# Altium project DB10005_DieBieMS.PrjPcb (part 1 of 2)
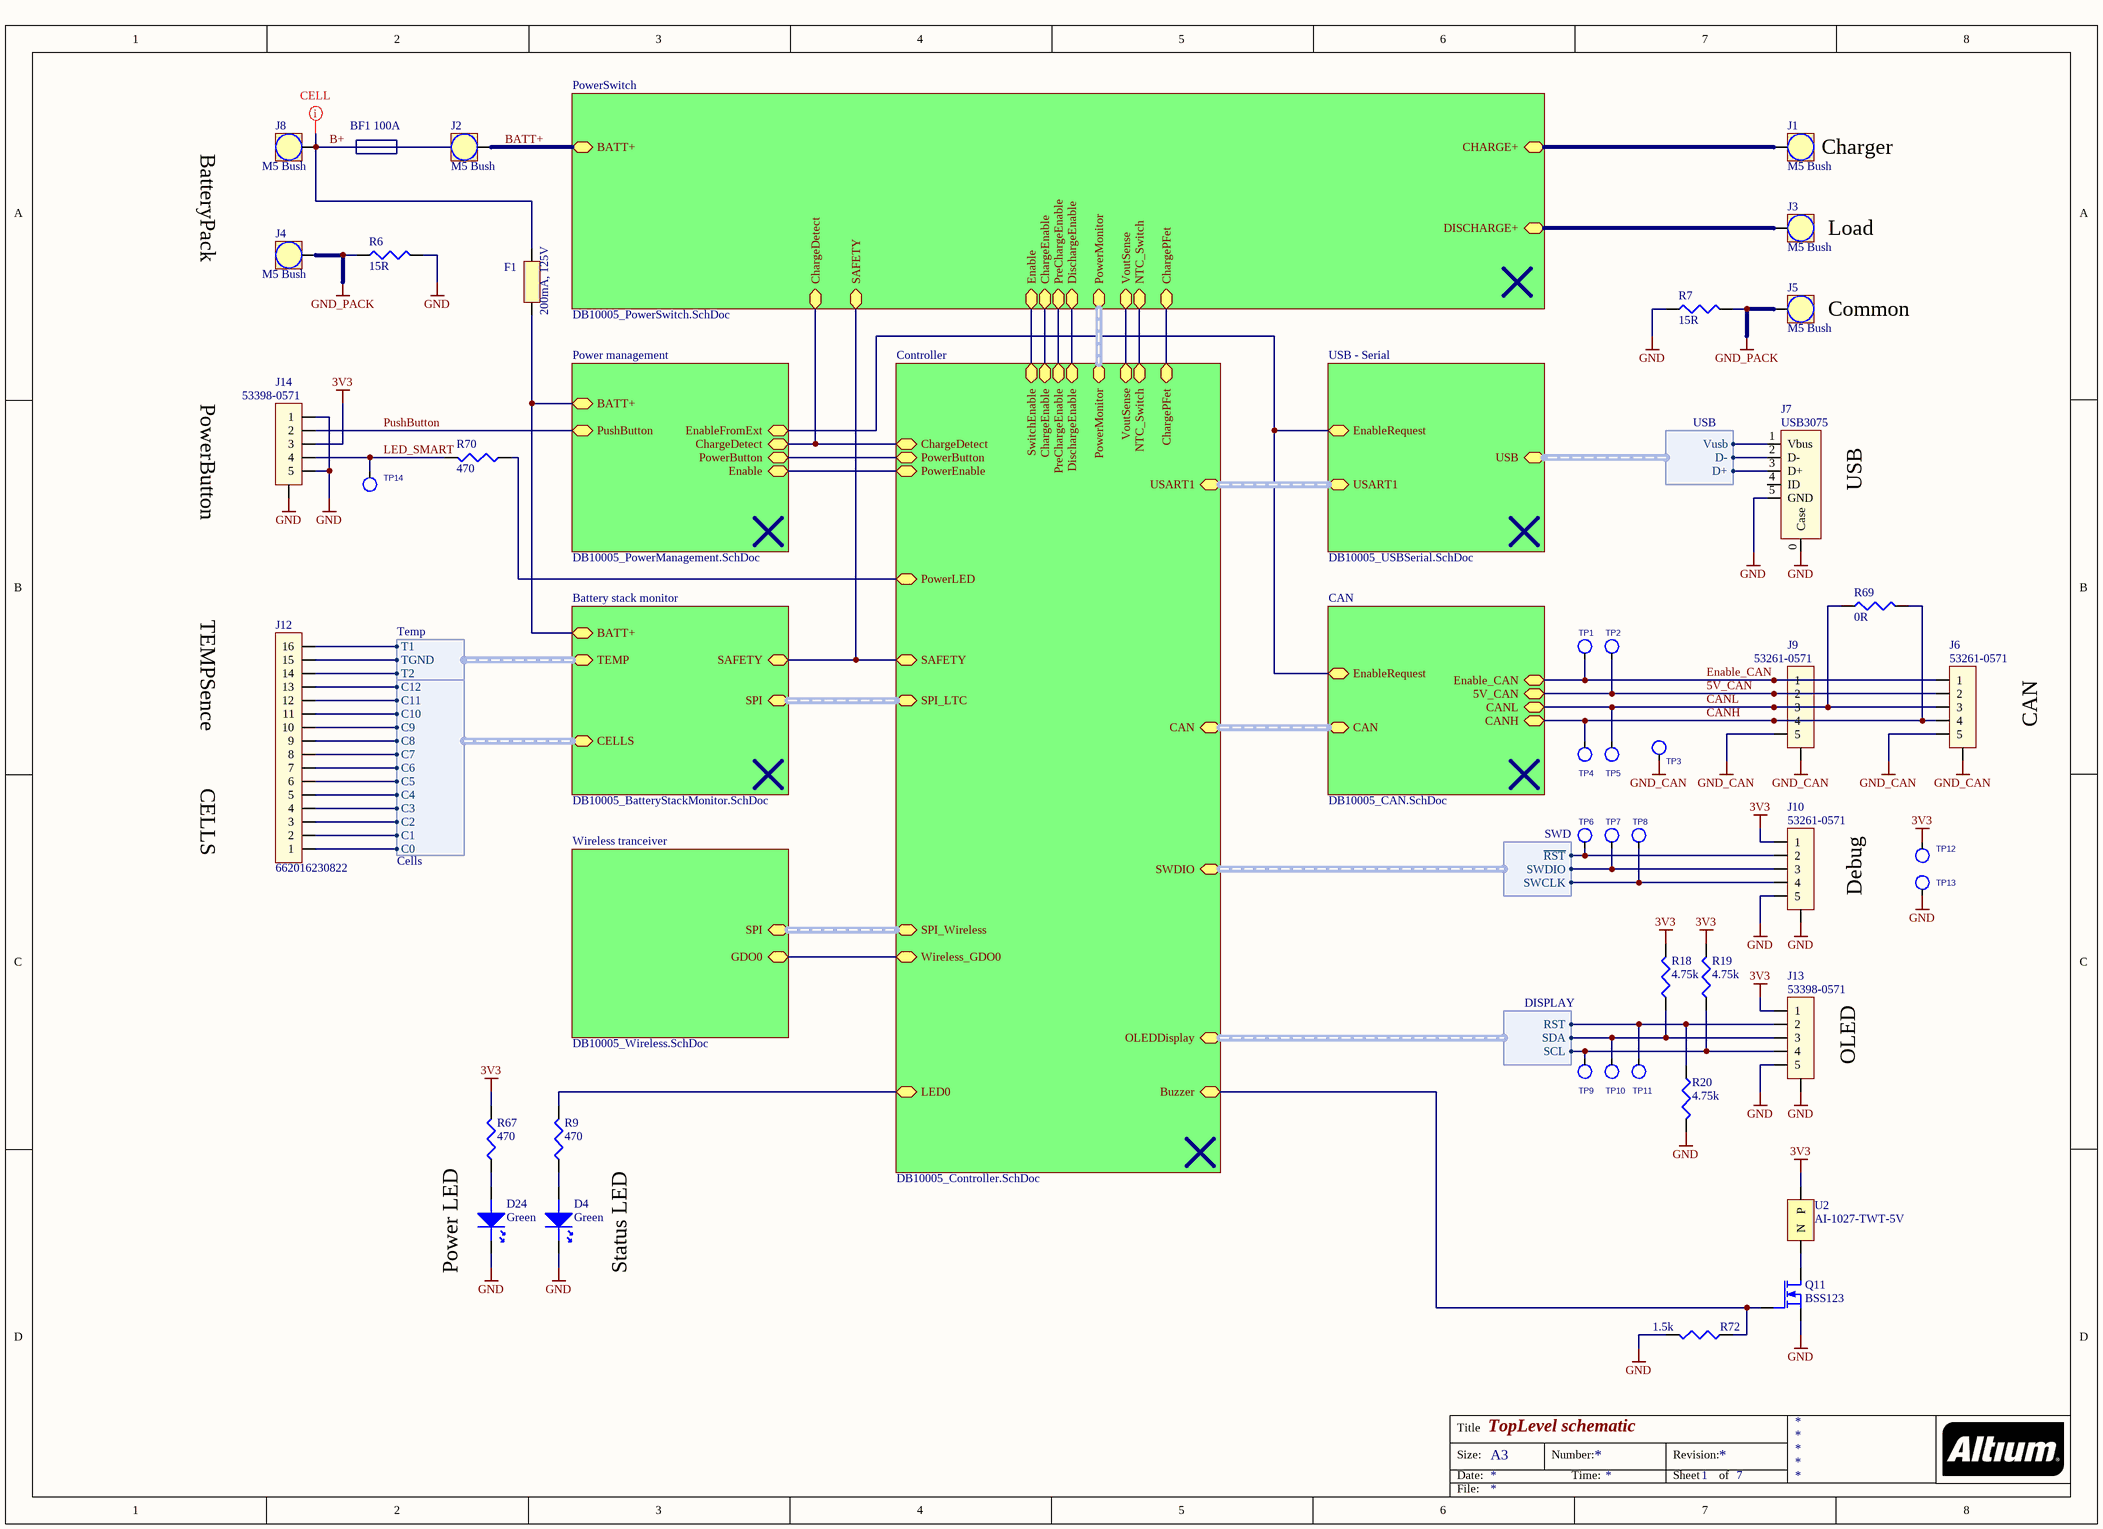
[diagram p0: DB10005_TopLevel.SchDoc]
10 sheets, 289 parts. Net scope: hierarchical (ports join the sheet entries above them; power ports are global).
Board file: DB10005_BMS.PcbDoc
Sheets:
  DB10005_TopLevel.SchDoc
    Battery stack monitor = DB10005_BatteryStackMonitor.SchDoc
      CELL1 = DB10005_CellNode.SchDoc
      CELL2 = DB10005_CellNode.SchDoc
      CELL3 = DB10005_CellNode.SchDoc
      CELL4 = DB10005_CellNode.SchDoc
      CELL5 = DB10005_CellNode.SchDoc
      CELL6 = DB10005_CellNode.SchDoc
      CELL7 = DB10005_CellNode.SchDoc
      CELL8 = DB10005_CellNode.SchDoc
      CELL9 = DB10005_CellNode.SchDoc
      CELL10 = DB10005_CellNode.SchDoc
      CELL11 = DB10005_CellNode.SchDoc
      CELL12 = DB10005_CellNode.SchDoc
    Controller = DB10005_Controller.SchDoc
    PowerSwitch = DB10005_PowerSwitch.SchDoc
    Power management = DB10005_PowerManagement.SchDoc
    CAN = DB10005_CAN.SchDoc
    USB - Serial = DB10005_USBSerial.SchDoc
    Wireless tranceiver = DB10005_Wireless.SchDoc
  DB10005_Software.SchDoc

## Sheet DB10005_TopLevel.SchDoc: TopLevel schematic
size A3; SheetNumber: 1; SheetTotal: 7

### Parts
D4  Green  [D-0805]
D24  Green  [D-0805]
F1  200mA, 125V  [F1206]
J1  M5 Bush  [7460408_HAL Surface]
J2  M5 Bush  [7460408_HAL Surface]
J3  M5 Bush  [7460408_HAL Surface]
J4  M5 Bush  [7460408_HAL Surface]
J5  M5 Bush  [7460408_HAL Surface]
J6  53261-0571  [53261-0571]
J7  USB3075  [USB3075 - NOSLOT]
J8  M5 Bush  [7460408_HAL Surface]
J9  53261-0571  [53261-0571]
J10  53261-0571  [53261-0571]
J12  662016230822  [662016230822]
J13  53398-0571  [53398-0571]
J14  53398-0571  [53398-0571]
Q11  BSS123  [SOT-23]
R6  15R  [2512]
R7  15R  [2512]
R9  470  [0402]
R18  4.75k  [0402]
R19  4.75k  [0402]
R20  4.75k  [0402]
R67  470  [0402]
R69  0R  [0805]
R70  470  [0402]
R72  1.5k  [0402]
TP1  1.3TP  [TP2-1.3MM]  (value not drawn)  (no BOM)
TP2  1.3TP  [TP2-1.3MM]  (value not drawn)  (no BOM)
TP3  1.3TP  [TP2-1.3MM]  (value not drawn)  (no BOM)
TP4  1.3TP  [TP2-1.3MM]  (value not drawn)  (no BOM)
TP5  1.3TP  [TP2-1.3MM]  (value not drawn)  (no BOM)
TP6  1.3TP  [TP2-1.3MM]  (value not drawn)  (no BOM)
TP7  1.3TP  [TP2-1.3MM]  (value not drawn)  (no BOM)
TP8  1.3TP  [TP2-1.3MM]  (value not drawn)  (no BOM)
TP9  1.3TP  [TP2-1.3MM]  (value not drawn)  (no BOM)
TP10  1.3TP  [TP2-1.3MM]  (value not drawn)  (no BOM)
TP11  1.3TP  [TP2-1.3MM]  (value not drawn)  (no BOM)
TP12  1.3TP  [TP2-1.3MM]  (value not drawn)  (no BOM)
TP13  1.3TP  [TP2-1.3MM]  (value not drawn)  (no BOM)
TP14  1.3TP  [TP2-1.3MM]  (value not drawn)  (no BOM)
U2  AI-1027-TWT-5V  [AI-1027-TWT]

### Sub-sheets
Battery stack monitor = DB10005_BatteryStackMonitor.SchDoc: SPI (harness SPI), CELLS (harness Cells), TEMP (harness Temp), BATT+, SAFETY
CAN = DB10005_CAN.SchDoc: CANH, CAN (harness CAN), CANL, 5V_CAN, Enable_CAN, EnableRequest
Controller = DB10005_Controller.SchDoc: SPI_LTC (harness SPI), PowerEnable, PowerButton, DischargeEnable, ChargeEnable, SwitchEnable, PreChargeEnable, CAN (harness CAN), USART1 (harness SERIAL), ChargeDetect, OLEDDisplay (harness DISPLAY), PowerLED, LED0, PowerMonitor (harness ISL), SWDIO (harness SWD), VoutSense, Buzzer, SAFETY, NTC_Switch, SPI_Wireless (harness SPI), Wireless_GDO0, ChargePFet
Power management = DB10005_PowerManagement.SchDoc: Enable, PowerButton, ChargeDetect, EnableFromExt, PushButton, BATT+
PowerSwitch = DB10005_PowerSwitch.SchDoc: DischargeEnable, ChargeEnable, Enable, PreChargeEnable, ChargeDetect, CHARGE+, DISCHARGE+, BATT+, PowerMonitor (harness ISL), VoutSense, SAFETY, NTC_Switch, ChargePFet
USB - Serial = DB10005_USBSerial.SchDoc: USB (harness USB), USART1 (harness SERIAL), EnableRequest
Wireless tranceiver = DB10005_Wireless.SchDoc: SPI (harness SPI), GDO0

### Harnesses
USB: Vusb, D+, D-
Cells: C1, C9, C2, C3, C4, C5, C6, C7, C8, C10, C11, C0, C12
Temp: T1, T2, TGND
DISPLAY: SDA, SCL, RST
SWD: SWCLK, SWDIO, ~{RST}

### Nets
3V3: J10.1 J13.1 J14.3 R18.2 R19.2 R67.2 TP12.1(TP) U2.P
5V_CAN: J6.2 J9.2 TP2.1(TP) ; sheet CAN/5V_CAN
GND: D4.K D24.K J7.0(Case) J7.5(GND) J10.0(SHLD) J10.5 J13.0(SHLD) J13.5 J14.0(SHLD) J14.1 J14.5 Q11.S R6.2 R7.2 R20.2 R72.2 TP13.1(TP)
GND_CAN: J6.0(SHLD) J6.5 J9.0(SHLD) J9.5 TP3.1(TP)
GND_PACK: J4.1 J5.1 R6.1 R7.1
B+: F1.2 J8.1
BATT+: J2.1 ; sheet PowerSwitch/BATT+
Buzzer: Q11.G R72.1 ; sheet Controller/Buzzer
CANH: J6.4 J9.4 R69.2 TP4.1(TP) ; sheet CAN/CANH
CANL: J6.3 J9.3 R69.1 TP5.1(TP) ; sheet CAN/CANL
ChargeEnable: sheet Controller/ChargeEnable, sheet PowerSwitch/ChargeEnable
ChargeIn: J1.1 ; sheet PowerSwitch/CHARGE+
CN1: J12.1 ; sheet Battery stack monitor/CELLS.C0
CN2: J12.2 ; sheet Battery stack monitor/CELLS.C1
CN3: J12.3 ; sheet Battery stack monitor/CELLS.C2
CN4: J12.4 ; sheet Battery stack monitor/CELLS.C3
CN5: J12.5 ; sheet Battery stack monitor/CELLS.C4
CN6: J12.6 ; sheet Battery stack monitor/CELLS.C5
CN7: J12.7 ; sheet Battery stack monitor/CELLS.C6
CN8: J12.8 ; sheet Battery stack monitor/CELLS.C7
CN9: J12.9 ; sheet Battery stack monitor/CELLS.C8
CN10: J12.10 ; sheet Battery stack monitor/CELLS.C9
CN11: J12.11 ; sheet Battery stack monitor/CELLS.C10
CN12: J12.12 ; sheet Battery stack monitor/CELLS.C11
CP12: J12.13 ; sheet Battery stack monitor/CELLS.C12
DischargeEnable: sheet Controller/DischargeEnable, sheet PowerSwitch/DischargeEnable
Enable_CAN: J6.1 J9.1 TP1.1(TP) ; sheet CAN/Enable_CAN
LED0: R9.2 ; sheet Controller/LED0
LED_SMART: J14.4 R70.2 TP14.1(TP)
LoadOut: J3.1 ; sheet PowerSwitch/DISCHARGE+
OLED_RST: J13.2 R20.1 TP11.1(TP) ; sheet Controller/OLEDDisplay.RST
OLED_SCL: J13.4 R19.1 TP9.1(TP) ; sheet Controller/OLEDDisplay.SCL
OLED_SDA: J13.3 R18.1 TP10.1(TP) ; sheet Controller/OLEDDisplay.SDA
PowerButton: sheet Controller/PowerButton, sheet Power management/PowerButton
PowerEnable: sheet Controller/PowerEnable, sheet Power management/Enable
PowerLED: R70.1 ; sheet Controller/PowerLED
PreChargeEnable: sheet Controller/PreChargeEnable, sheet PowerSwitch/PreChargeEnable
PushButton: J14.2 ; sheet Power management/PushButton
~{RST}: J10.2 TP6.1(TP) ; sheet Controller/SWDIO.~{RST}
SWCLK: J10.4 TP8.1(TP) ; sheet Controller/SWDIO.SWCLK
SWDIO: J10.3 TP7.1(TP) ; sheet Controller/SWDIO.SWDIO
SwitchEnable: sheet Controller/SwitchEnable, sheet PowerSwitch/Enable
VoutSense: sheet Controller/VoutSense, sheet PowerSwitch/VoutSense
Wireless_GDO0: sheet Controller/Wireless_GDO0, sheet Wireless tranceiver/GDO0
NetC17_2: J7.1(Vbus) ; sheet USB - Serial/USB.Vusb
NetC40_2: J12.16 ; sheet Battery stack monitor/TEMP.T1
NetC41_2: J12.14 ; sheet Battery stack monitor/TEMP.T2
NetC42_1: sheet Controller/NTC_Switch, sheet PowerSwitch/NTC_Switch
NetD2_4: sheet Controller/ChargeDetect, sheet PowerSwitch/ChargeDetect, sheet Power management/ChargeDetect
NetD3_K1: J7.2(D-) ; sheet USB - Serial/USB.D-
NetD3_K2: J7.3(D+) ; sheet USB - Serial/USB.D+
NetD4_A: D4.A R9.1
NetD6_4: sheet Power management/EnableFromExt, sheet CAN/EnableRequest, sheet USB - Serial/EnableRequest
NetD24_A: D24.A R67.1
NetF1_1: F1.1 ; sheet Battery stack monitor/BATT+, sheet Power management/BATT+
NetIC1_2: sheet Battery stack monitor/SAFETY, sheet Controller/SAFETY, sheet PowerSwitch/SAFETY
NetJ12_15: J12.15 ; sheet Battery stack monitor/TEMP.TGND
NetQ11_D: Q11.D U2.N
(unnamed): sheet Controller/ChargePFet, sheet PowerSwitch/ChargePFet

Not connected (* = marked no-connect by the designer): J7 4(ID)

### Buses and harness runs
harness sheet Battery stack monitor/SPI = sheet Controller/SPI_LTC
harness sheet CAN/CAN = sheet Controller/CAN
harness sheet Controller/PowerMonitor = sheet PowerSwitch/PowerMonitor
harness sheet Controller/SPI_Wireless = sheet Wireless tranceiver/SPI
harness sheet Controller/USART1 = sheet USB - Serial/USART1

### Layout directives
net class CELL: B+

### Notes on the sheet
- (near J8) BF1 100A
- BatteryPack
- (near J1) Charger
- (near J3) Load
- (near J5) Common
- PowerButton
- (near J7) USB
- TEMPSence
- CAN
- CELLS
- Debug
- (near J13) OLED
- Power LED
- Status LED
- Title
- Size:
- Date:
- A3
- Number:
- Time:
- Revision:
- Sheet
- of
- File:

### Library data of the parts
D4 D24 = KP-2012SGC: Led, Green, Li:12mcd, Vf:2.2V, If:0.02A; Brand: KingBright; Case Style: 0805; Forward Current: 0.02A; Forward Voltage: 2.2V; Luminous Intensity: 12mcd; Brand Number: KP-2012SGC; Order Code Supplier: 1318243; Price: 0,06; Supplier: Farnell; Temperature Range: -30°C to +85°C
F1 = 0466.200NR: Fuse, Slow Blow, 200 mA, 125 VAC, 125 VDC; Brand: LITTELFUSE; Prijs: 0,347; Order Code Supplier: 1596522; Brand Number: 0466.200NR; Supplier: Farnell
J1-J5 J8 = 7460408: Bush with Circumference M5; Brand: Wurth; Case Style: M5Bush; Brand Number: 7460408; Order Code Supplier: 1821279; Price: 4,17; Supplier: Farnell
J6 J9 J10 = 53261-0571: PicoBlade 53261 Series, 5Pin, Right Angle; Brand: MOLEX; Pitch: 1.25mm; Brand Number: 53261-0571; Case Style: 53261-0571; Order Code Supplier: 1125360; Price: 1,20; Supplier: Farnell
J7 = USB3075: USB 2.0 MICRO B, RCPT, 5POS, SMT; Brand: Global Connector Technology; Brand Number: USB3075-30-A; Case Style: Micro B SMT; Pitch: 0.8mm; Order Code Supplier: 2443116; Price: 0,313; Supplier: Farnell
J12 = 662016230822: WR-MPC3 Series, Surface Mount, Header, 16 Contacts, 3 mm; Brand: Wurth; Case Style: 3mm BoxHeader; Pitch: 3mm; Brand Number: 662016230822; Order Code Supplier: 2113471; Price: 2,67; Supplier: Farnell
J13 J14 = 53398-0571: PicoBlade 53398 Series, 5Pin, Right Angle; Brand: MOLEX; Pitch: 1.25mm; Brand Number: 53398-0571; Case Style: 53398-0571; Order Code Supplier: 1125354; Price: 1,55; Supplier: Farnell
Q11 = BSS123: Mosfet, N-channel, Vds:100V, Id:0.15A, Vgs-th:2.8V, Rds-on:3.5ohm; Brand: NXP; Drain Current: 0.15A; Drain Source Voltage: 100V; Gate Source Voltage: 20V; On Resistance: 3.5ohm; Threshold Voltage: 2.8V; Brand Number: BSS123; Case Style: SOT-23; Order Code Supplier: 1510764; Price: 0,082; Supplier: Farnell; Temperature Range: -55°C to +150°C; Transistor Polarity: N-channel
R6 R7 = 15/2512/2W/250V: Resistor, 15R, 1%, 2W, 200V, 200PPM, 2512; Brand: TE CONNECTIVITY / CGS; Brand Number: 352115RFT; Voltage Rating: 250V; Case Style: 2512; Order Code Supplier: 2117454; Power Rating: 2W; Price: 0,30; Resistance: 15R; Supplier: Farnell; Temperature Coefficient: ± 200PPM; Temperature Range: -55°C to +125°C
R9 R67 R70 = 470/0402/0063W/50V: Resistor, 470, 1%, 0.0625W, 50V, 100PPM, 0402; Brand: VISHAY DRALORIC; Brand Number: CRG0402F470R; Power Rating: 0.063W; Case Style: 0402; Order Code Supplier: 2331533; Price: 0,0099; Resistance: 470; Supplier: Farnell; Temperature Coefficient: ± 100PPM; Temperature Range: -55°C to +125°C; Voltage Rating: 50V
R18-R20 = 4.75k/0402/0063W/50V: Resistor, 4.75k, 0.1%, 0.0625W, 50V, 100PPM, 0402; Brand: VISHAY DRALORIC; Brand Number: CRCW04024K75FKED; Power Rating: 0.063W; Case Style: 0402; Order Code Supplier: 2121689; Price: 0,0006; Resistance: 4.75k; Supplier: Farnell; Temperature Coefficient: ± 100PPM; Temperature Range: -55°C to +125°C; Voltage Rating: 50V
R69 = 0/0805/0100W/150V: Resistor, 0R, 0.1%, 0.1W, 150V, 200PPM, 0805; Brand: MULTICOMP; Brand Number: MC 0.1W 0805 0R; Case Style: 0805; Order Code Supplier: 9333681; Power Rating: 0.1W; Price: 0,038; Resistance: 0R; Supplier: Farnell; Temperature Coefficient: ± 200PPM; Temperature Range: -55°C to +125°C; Voltage Rating: 150V
R72 = 1.5k/0402/0063W/50V: Resistor, 1.5k, 0.1%, 0.0625W, 50V, 100PPM, 0402; Brand: VISHAY DRALORIC; Brand Number: CRCW04021K50FKED; Power Rating: 0.063W; Case Style: 0402; Order Code Supplier: 2121624; Price: 0,0054; Resistance: 1.5k; Supplier: Farnell; Temperature Coefficient: ± 100PPM; Temperature Range: -55°C to +125°C; Voltage Rating: 50V
TP1-TP14 = TESTPT4: 1.3mm
U2 = AI-1027-TWT-5V-2-R: EM 5VDC 2300Hz 82dBA Continuous Top Fire; Brand: PUI Audio; Brand Number: AI-1027-TWT-5V-2-R; Case Style: AI-1027-TWT-5V-2-R; Price: 1,73; Order Code Supplier: 665-AI1027TWT5V2R; Supplier: Mouser

## Sheet DB10005_BatteryStackMonitor.SchDoc: Battery stack monitor
size A3; SheetNumber: 2; SheetTotal: 7
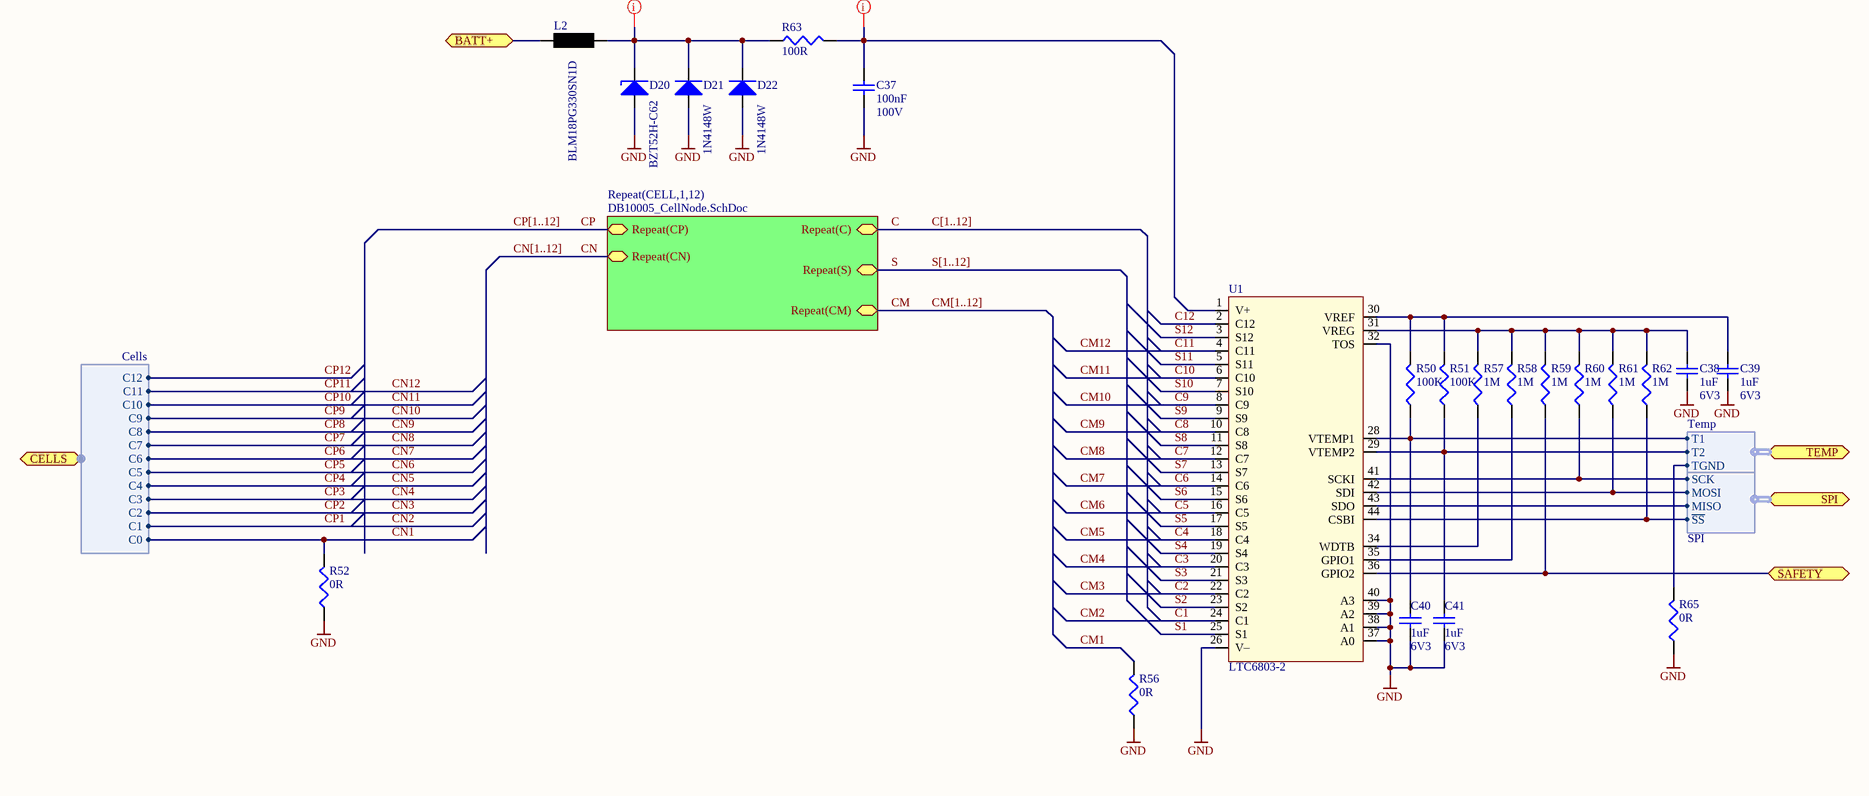
[diagram p1: DB10005_BatteryStackMonitor.SchDoc]

### Parts
C37  100nF  Voltage Rating: 100V  [C-0805]
C38  1uF  Voltage Rating: 6V3  [C0402]
C39  1uF  Voltage Rating: 6V3  [C0402]
C40  1uF  Voltage Rating: 6V3  [C0402]
C41  1uF  Voltage Rating: 6V3  [C0402]
D20  BZT52H-C62  [SOD123W]
D21  1N4148W  [SOD123]
D22  1N4148W  [SOD123]
L2  BLM18PG330SN1D  [L0603]
R50  100K  [0402]
R51  100K  [0402]
R52  0R  [0603]
R56  0R  [0603]
R57  1M  [0402]
R58  1M  [0402]
R59  1M  [0402]
R60  1M  [0402]
R61  1M  [0402]
R62  1M  [0402]
R63  100R  [0603]
R65  0R  [0603]
U1  LTC6803-2  [SSOP44]

### Sub-sheets
Repeat(CELL,1,12) = DB10005_CellNode.SchDoc: Repeat(CN), Repeat(CP), Repeat(S), Repeat(C), Repeat(CM)

### Ports
BATT+, CELLS (harness Cells), SAFETY, SPI (harness SPI), TEMP (harness Temp)

### Harnesses
SPI: ~{SS}, SCK, MISO, MOSI
Cells: C1, C9, C2, C3, C4, C5, C6, C7, C8, C10, C11, C0, C12
Temp: T1, T2, TGND

### Nets
GND: C37.1 C38.1 C39.1 C40.1 C41.1 D20.1 D21.1(A) D22.1(A) R52.1 R56.1 R65.1 U1.26(V–) U1.32(TOS) U1.37(A0) U1.38(A1) U1.39(A2) U1.40(A3)
C: sheet Repeat(CELL,1,12)/Repeat(C)
C1: U1.24(C1)  [also labelled CM2]
C2: U1.22(C2)  [also labelled CM3]
C3: U1.20(C3)  [also labelled CM4]
C4: U1.18(C4)  [also labelled CM5]
C5: U1.16(C5)  [also labelled CM6]
C6: U1.14(C6)  [also labelled CM7]
C7: U1.12(C7)  [also labelled CM8]
C8: U1.10(C8)  [also labelled CM9]
C9: U1.8(C9)  [also labelled CM10]
C10: U1.6(C10)  [also labelled CM11]
C11: U1.4(C11)  [also labelled CM12]
C12: U1.2(C12)
CM: sheet Repeat(CELL,1,12)/Repeat(CM)
CM1: R56.2
CN: sheet Repeat(CELL,1,12)/Repeat(CN)
CN1: R52.2 ; port CELLS.C0
CP: sheet Repeat(CELL,1,12)/Repeat(CP)
MISO: U1.43(SDO) ; port SPI.MISO
MOSI: R61.1 U1.42(SDI) ; port SPI.MOSI
S: sheet Repeat(CELL,1,12)/Repeat(S)
S1: U1.25(S1)
S2: U1.23(S2)
S3: U1.21(S3)
S4: U1.19(S4)
S5: U1.17(S5)
S6: U1.15(S6)
S7: U1.13(S7)
S8: U1.11(S8)
S9: U1.9(S9)
S10: U1.7(S10)
S11: U1.5(S11)
S12: U1.3(S12)
~{SS}: R62.1 U1.44(CSBI) ; port SPI.~{SS}
SCK: R60.1 U1.41(SCKI) ; port SPI.SCK
NetC37_2: C37.2 R63.2 U1.1(V+)
NetC38_2: C38.2 R57.2 R58.2 R59.2 R60.2 R61.2 R62.2 U1.31(VREG)
NetC39_2: C39.2 R50.2 R51.2 U1.30(VREF)
NetC40_2: C40.2 R50.1 U1.28(VTEMP1) ; port TEMP.T1
NetC41_2: C41.2 R51.1 U1.29(VTEMP2) ; port TEMP.T2
NetD20_2: D20.2 D21.2(K) D22.2(K) L2.2 R63.1
NetF1_1: L2.1 ; port BATT+
NetIC1_2: R59.1 U1.36(GPIO2) ; port SAFETY
NetJ12_15: R65.2 ; port TEMP.TGND
NetR57_1: R57.1 U1.34(WDTB)
NetR58_1: R58.1 U1.35(GPIO1)

### Buses and harness runs
bus C[1..12]
bus CM[1..12]
bus CN[1..12]
bus CP[1..12]
bus S[1..12]

### Layout directives
net class CELL: NetC37_2, NetD20_2

### Notes on the sheet
- Title
- Size:
- Date:
- A3
- Number:
- Time:
- Revision:
- Sheet
- of
- File:

### Library data of the parts
C37 = 100nF/0805/CER/100V: Capacitor, 100nF, 100V, X7R; Capacitance Tolerance: ± 10%; Capacitor Case Style: 0805; Brand Number: C0805C104K1RACTU; Brand: KEMET; Dielectric Characteristic: X7R; Capacitance: 100nF; Temperature Range: -55°C to +125°C; Price: 0,096; Order Code Supplier: 1650862; Supplier: Farnell
C38-C41 = 1uF/0402/CER/6.3V: Capacitor, 1uF, 6.3V, X5R; Capacitance Tolerance: ± 10%; Capacitor Case Style: 0402; Brand Number: 04026D105KAT2A; Brand: AVX; Dielectric Characteristic: X5R; Capacitance: 1uF; Temperature Range: -55°C to +85°C; Price: 0,0874; Order Code Supplier: 1327658; Supplier: Farnell
D20 = BZT52H-C62,115: Diode Zener, Vz: 62V, If: 0.25A, Vf: 0.9V; Brand: NXP; Case Style: SOD-123F; Brand Number: BZT52H-C62,115; Forward Current: 0.25A; Forward Voltage: 0.9V; Order Code Supplier: 1757813RL; Price: 0,053; Supplier: Farnell; Temperature Range: -65°C to +150°C; Zener Voltage: 62V
D21 D22 = MMSD4148T1G: Diode, Vrrm: 100V, If: 0.15A, Vf: 1V; Brand: ON SEMICONDUCTOR; Case Style: SOD-123; Forward Current: 0.2A; Brand Number: MMSD4148T1G; Forward Voltage: 1V; Order Code Supplier: 9556079; Price: 0,19; Supplier: Farnell; Temperature Range: -65°C to +150°C; Vrrm: 100V
L2 = BLM18PG330SN1D: Ferrite Bead, Impedance:33ohm, DC Resistance Max:0.025ohm, DC Current Rating:3A; Brand: MURATA; Case Style: 0603; Brand Number: BLM18PG330SN1D; Price: 0,048; Supplier: Farnell; Order Code Supplier: 1515742
R50 R51 = 100k/0402/0063W/50V: Resistor, 100k, 0.1%, 0.0625W, 50V, 100PPM, 0402; Brand: VISHAY DRALORIC; Brand Number: CRCW0402100KFKED; Power Rating: 0.063W; Case Style: 0402; Order Code Supplier: 2121857; Price: 0,0004; Resistance: 100K; Supplier: Farnell; Temperature Coefficient: ± 100PPM; Temperature Range: -55°C to +125°C; Voltage Rating: 50V
R52 R56 R65 = 0/0603/0063W/50V: Resistor, 0R, 0.1%, 0.063W, 50V, 200PPM, 0603; Brand: VISHAY DRALORIC; Brand Number: CRCW06030000Z0EA; Case Style: 0603; Order Code Supplier: 2122112; Power Rating: 0.063W; Price: 0,043; Resistance: 0R; Supplier: Farnell; Temperature Coefficient: ± 200PPM; Temperature Range: -55°C to +125°C; Voltage Rating: 50V
R57-R62 = 1M/0402/0063W/50V: Resistor, 1M, 0.1%, 0.0625W, 50V, 100PPM, 0402; Brand: VISHAY DRALORIC; Brand Number: CRCW04021M00FKED; Power Rating: 0.063W; Case Style: 0402; Order Code Supplier: 2121984; Price: 0,0006; Resistance: 1M; Supplier: Farnell; Temperature Coefficient: ± 100PPM; Temperature Range: -55°C to +125°C; Voltage Rating: 50V
R63 = 100/0603/0063W/50V: Resistor, 100R, 1%, 0.063W, 50V, 200PPM, 0603; Brand: VISHAY DRALORIC; Brand Number: CRCW0603100RFKEA; Case Style: 0603; Order Code Supplier: 2122239; Power Rating: 0.063W; Price: 0,007; Resistance: 100R; Supplier: Farnell; Temperature Coefficient: ± 200PPM; Temperature Range: -55°C to +125°C; Voltage Rating: 50V
U1 = LTC6803-2: Multicell Battery Stack Monitor, T:-40°C to +85°C; Brand Number: LTC6803IG-2#PBF; Brand: Linear Technology; Case Style: SSOP-44; Price: 14,08; Supplier: RS-Online; Temperature Range: -40°C to 85°C; Order Code Supplier: 858-0829

## Sheet DB10005_CellNode.SchDoc
size A4
Used 12 times, as channels Battery stack monitor/CELL1, Battery stack monitor/CELL2, Battery stack monitor/CELL3, Battery stack monitor/CELL4, Battery stack monitor/CELL5, Battery stack monitor/CELL6, Battery stack monitor/CELL7, Battery stack monitor/CELL8, Battery stack monitor/CELL9, Battery stack monitor/CELL10, Battery stack monitor/CELL11, Battery stack monitor/CELL12. Parts and nets are listed once, with the designators drawn on the sheet.
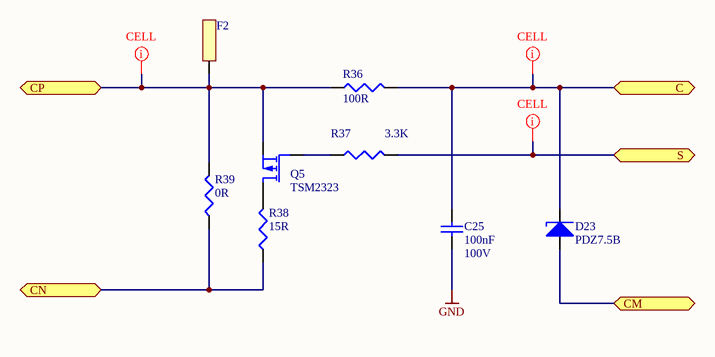
[diagram p2: DB10005_CellNode.SchDoc]

### Parts
C25  100nF  Voltage Rating: 100V  [C-0805]
D23  PDZ7.5B  [SOD-323]
F2  PCB Fuse  [0603_Fuse_0_2MM]  (value not drawn)  (no BOM)
Q5  TSM2323  [SOT-23]
R36  100R  [0603]
R37  3.3K  [0603]
R38  15R  [2512]
R39  0R  [0805]

### Ports
C, CM, CN, CP, S

### Nets
GND: C25.1
C: C25.2 D23.2 R36.2 ; port C
CM: D23.1 ; port CM
CN: R38.1 R39.1 ; port CN
CP: F2.1 Q5.S R36.1 R39.2 ; port CP
S: R37.2 ; port S
NetQ5_D: Q5.D R38.2
NetQ5_G: Q5.G R37.1

### Channels
Battery stack monitor/CELL1: designators end in _CELL1; ports C=C1 CM=CM1 CN=CN1 CP=CN2 S=S1
Battery stack monitor/CELL2: designators end in _CELL2; ports C=C2 CM=C1 CN=CN2 CP=CN3 S=S2
Battery stack monitor/CELL3: designators end in _CELL3; ports C=C3 CM=C2 CN=CN3 CP=CN4 S=S3
Battery stack monitor/CELL4: designators end in _CELL4; ports C=C4 CM=C3 CN=CN4 CP=CN5 S=S4
Battery stack monitor/CELL5: designators end in _CELL5; ports C=C5 CM=C4 CN=CN5 CP=CN6 S=S5
Battery stack monitor/CELL6: designators end in _CELL6; ports C=C6 CM=C5 CN=CN6 CP=CN7 S=S6
Battery stack monitor/CELL7: designators end in _CELL7; ports C=C7 CM=C6 CN=CN7 CP=CN8 S=S7
Battery stack monitor/CELL8: designators end in _CELL8; ports C=C8 CM=C7 CN=CN8 CP=CN9 S=S8
Battery stack monitor/CELL9: designators end in _CELL9; ports C=C9 CM=C8 CN=CN9 CP=CN10 S=S9
Battery stack monitor/CELL10: designators end in _CELL10; ports C=C10 CM=C9 CN=CN10 CP=CN11 S=S10
Battery stack monitor/CELL11: designators end in _CELL11; ports C=C11 CM=C10 CN=CN11 CP=CN12 S=S11
Battery stack monitor/CELL12: designators end in _CELL12; ports C=C12 CM=C11 CN=CN12 CP=CP12 S=S12

### Layout directives
net class CELL: C1, CN2, S1

### Library data of the parts
C25 = 100nF/0805/CER/100V: as C37 on sheet DB10005_BatteryStackMonitor; Dielectric Characteristic: X7R; Capacitance: 100nF; Temperature Range: -55°C to +125°C; Price: 0,096; Order Code Supplier: 1650862; Supplier: Farnell
D23 = PDZ7.5B: Diode, Vrrm: 7.5V, If: 0.2A, Vf: 0.9V; Brand: NXP; Brand Number: PDZ7.5B,115; Case Style: SOD-323; Forward Current: 0.2A; Forward Voltage: 0.9V; Order Code Supplier: 2319197; Price: 0,263; Supplier: Farnell; Temperature Range: -65°C to +150°C; Zener Voltage: 7.5V
F2 = PCBFuse_0_2MM: Fuse, PCB, 1A, 60V, T:-40°C +85°C; Price: 0,00; Order Code Supplier: -; Brand: -; Brand Number: -; Supplier: Farnell
Q5 = TSM2323: Mosfet, P-channel, Vds:20V, Id:4.7A, Vgs-th:1V, Rds-on:0.039ohm; Brand: Taiwan Semiconductor; Brand Number: TSM2323CX; Drain Current: 4.7A; Drain Source Voltage: 20V; Gate Source Voltage: 8V; Threshold Voltage: 1V; Case Style: SOT-23; On Resistance: 0.039ohm; Order Code Supplier: 1864590; Price: 0,195; Supplier: Farnell; Temperature Range: -55°C to +150°C; Transistor Polarity: P-channel
R36 = 100/0603/0063W/50V: as R63 on sheet DB10005_BatteryStackMonitor; Case Style: 0603; Order Code Supplier: 2122239; Power Rating: 0.063W; Price: 0,007; Resistance: 100R; Supplier: Farnell; Temperature Coefficient: ± 200PPM; Temperature Range: -55°C to +125°C; Voltage Rating: 50V
R37 = 3.3K/0603/0125W/50V: Resistor, 3.3K, 1%, 0.125W, 50V, 100PPM, 0603; Brand: MULTICOMP; Brand Number: MCHP03W8F3301T5E; Case Style: 0603; Order Code Supplier: 1576291; Power Rating: 0.125W; Price: 0,08; Resistance: 3.3K; Supplier: Farnell; Temperature Coefficient: ± 100PPM; Temperature Range: -55°C to +155°C; Voltage Rating: 50V
R38 = 15/2512/2W/250V: as R6 on sheet DB10005_TopLevel; Case Style: 2512; Order Code Supplier: 2117454; Power Rating: 2W; Price: 0,30; Resistance: 15R; Supplier: Farnell; Temperature Coefficient: ± 200PPM; Temperature Range: -55°C to +125°C
R39 = 0/0805/0100W/150V: as R69 on sheet DB10005_TopLevel; Case Style: 0805; Order Code Supplier: 9333681; Power Rating: 0.1W; Price: 0,038; Resistance: 0R; Supplier: Farnell; Temperature Coefficient: ± 200PPM; Temperature Range: -55°C to +125°C; Voltage Rating: 150V

## Sheet DB10005_Controller.SchDoc: Controller
size A3; SheetNumber: 3; SheetTotal: 7
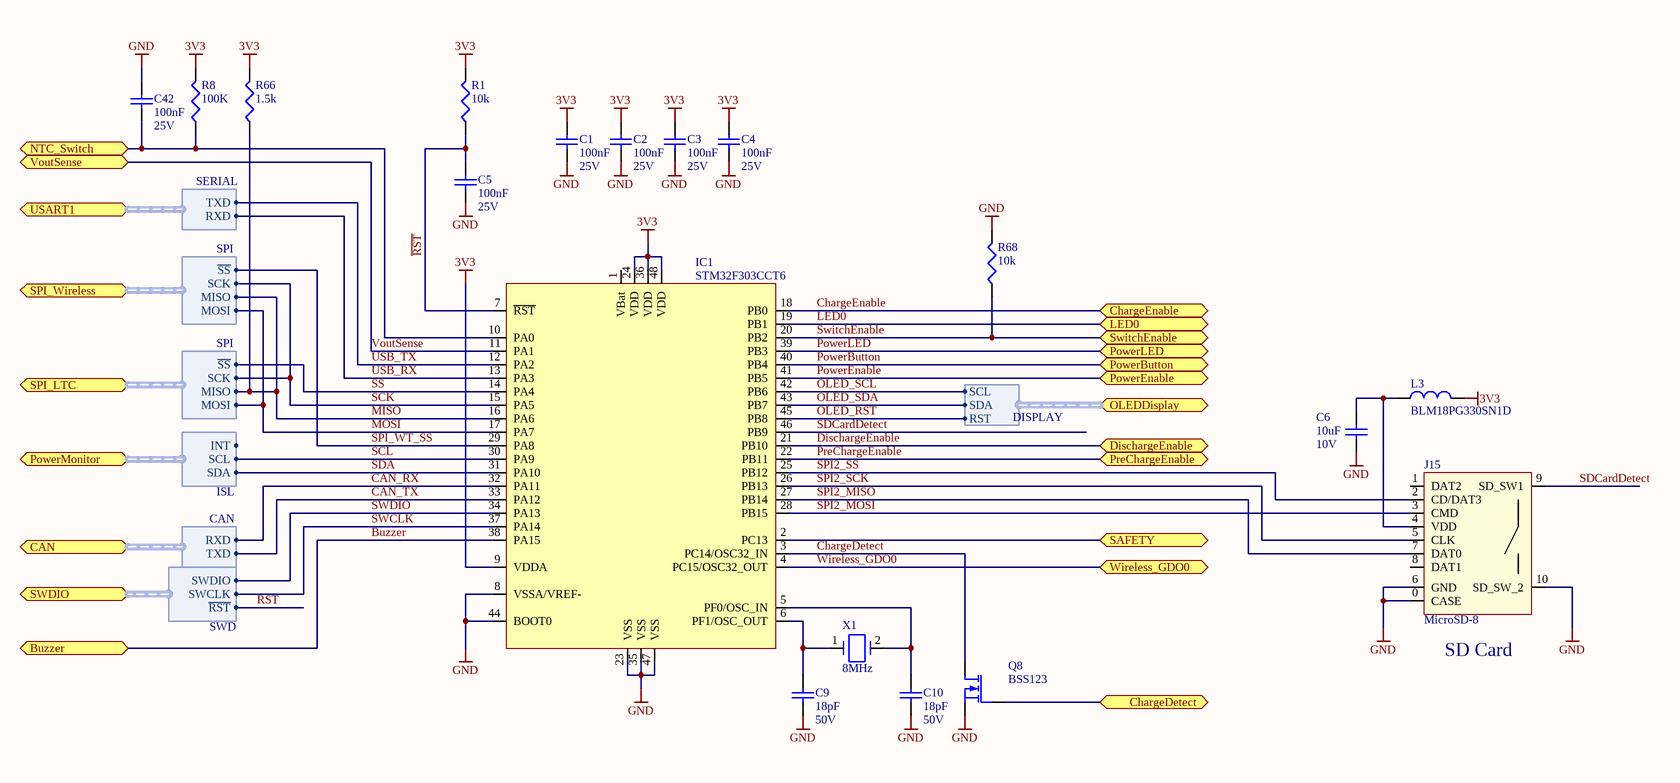
[diagram p3: DB10005_Controller.SchDoc]

### Parts
C1  100nF  Voltage Rating: 25V  [C0402]
C2  100nF  Voltage Rating: 25V  [C0402]
C3  100nF  Voltage Rating: 25V  [C0402]
C4  100nF  Voltage Rating: 25V  [C0402]
C5  100nF  Voltage Rating: 25V  [C0402]
C6  10uF  Voltage Rating: 10V  [C-0805]
C9  18pF  Voltage Rating: 50V  [C0402]
C10  18pF  Voltage Rating: 50V  [C0402]
C42  100nF  Voltage Rating: 25V  [C0402]
IC1  STM32F303CCT6  [LQFP48]
J15  MicroSD-8  [microSD]
L3  BLM18PG330SN1D  [L0603]
Q8  BSS123  [SOT-23]
R1  10k  [0402]
R8  100K  [0402]
R66  1.5k  [0402]
R68  10k  [0402]
X1  8MHz  [XTAL150SMD_125X196]

### Ports
Buzzer, CAN (harness CAN), ChargeDetect, ChargeEnable, DischargeEnable, LED0, NTC_Switch, OLEDDisplay (harness DISPLAY), PowerButton, PowerEnable, PowerLED, PowerMonitor (harness ISL), PreChargeEnable, SAFETY, SPI_LTC (harness SPI), SPI_Wireless (harness SPI), SWDIO (harness SWD), SwitchEnable, USART1 (harness SERIAL), VoutSense, Wireless_GDO0

### Harnesses
SERIAL: RXD, TXD
DISPLAY: SDA, SCL, RST
CAN: RXD, TXD
SPI: ~{SS}, SCK, MISO, MOSI
ISL: SDA, SCL, INT
SWD: SWCLK, SWDIO, ~{RST}

### Nets
3V3: C1.2 C2.2 C3.2 C4.2 IC1.9(VDDA) IC1.24(VDD) IC1.36(VDD) IC1.48(VDD) L3.2 R1.2 R8.2 R66.2
GND: C1.1 C2.1 C3.1 C4.1 C5.1 C6.1 C9.1 C10.1 C42.2 IC1.8(VSSA/VREF-) IC1.23(VSS) IC1.35(VSS) IC1.44(BOOT0) IC1.47(VSS) J15.0(CASE) J15.6(GND) J15.10(SD_SW_2) Q8.S R68.2
Buzzer: IC1.38(PA15) ; port Buzzer
CAN_RX: IC1.32(PA11) ; port CAN.RXD
CAN_TX: IC1.33(PA12) ; port CAN.TXD
ChargeDetect: IC1.3(PC14/OSC32_IN) Q8.D
ChargeEnable: IC1.18(PB0) ; port ChargeEnable
DischargeEnable: IC1.21(PB10) ; port DischargeEnable
LED0: IC1.19(PB1) ; port LED0
MISO: IC1.16(PA6) R66.1 ; port SPI_LTC.MISO, port SPI_Wireless.MISO
MOSI: IC1.17(PA7) ; port SPI_LTC.MOSI, port SPI_Wireless.MOSI
OLED_RST: IC1.45(PB8) ; port OLEDDisplay.RST
OLED_SCL: IC1.42(PB6) ; port OLEDDisplay.SCL
OLED_SDA: IC1.43(PB7) ; port OLEDDisplay.SDA
PowerButton: IC1.40(PB4) ; port PowerButton
PowerEnable: IC1.41(PB5) ; port PowerEnable
PowerLED: IC1.39(PB3) ; port PowerLED
PreChargeEnable: IC1.22(PB11) ; port PreChargeEnable
~{RST}: C5.2 IC1.7(~{RST}) R1.1 ; port SWDIO.~{RST}
~{SS}: IC1.14(PA4) ; port SPI_LTC.~{SS}
SCK: IC1.15(PA5) ; port SPI_LTC.SCK, port SPI_Wireless.SCK
SCL: IC1.30(PA9) ; port PowerMonitor.SCL
SDA: IC1.31(PA10) ; port PowerMonitor.SDA
SDCardDetect: IC1.46(PB9) J15.9(SD_SW1)
SPI2_MISO: IC1.27(PB14) J15.7(DAT0)
SPI2_MOSI: IC1.28(PB15) J15.3(CMD)
SPI2_SCK: IC1.26(PB13) J15.5(CLK)
SPI2_SS: IC1.25(PB12) J15.2(CD/DAT3)
SPI_WT_SS: IC1.29(PA8) ; port SPI_Wireless.~{SS}
SWCLK: IC1.37(PA14) ; port SWDIO.SWCLK
SWDIO: IC1.34(PA13) ; port SWDIO.SWDIO
SwitchEnable: IC1.20(PB2) R68.1 ; port SwitchEnable
USB_RX: IC1.13(PA3) ; port USART1.RXD
USB_TX: IC1.12(PA2) ; port USART1.TXD
VoutSense: IC1.11(PA1) ; port VoutSense
Wireless_GDO0: IC1.4(PC15/OSC32_OUT) ; port Wireless_GDO0
NetC6_2: C6.2 J15.4(VDD) L3.1
NetC9_2: C9.2 IC1.6(PF1/OSC_OUT) X1.1
NetC10_2: C10.2 IC1.5(PF0/OSC_IN) X1.2
NetC42_1: C42.1 IC1.10(PA0) R8.1 ; port NTC_Switch
NetD2_4: Q8.G ; port ChargeDetect
NetIC1_2: IC1.2(PC13) ; port SAFETY

Not connected (* = marked no-connect by the designer): IC1 1(VBat); J15 1(DAT2) 8(DAT1)

### Notes on the sheet
- (near J15) SD Card
- Title
- Size:
- Date:
- A3
- Number:
- Time:
- Revision:
- Sheet
- of
- File:

### Library data of the parts
C1-C5 C42 = 100nF/0402/CER/25V: Capacitor, 100nF, 25V, X7R; Capacitance Tolerance: 10nF; Capacitor Case Style: 0402; Brand Number: GRM155R71E104KE14D; Brand: MULTICOMP; Dielectric Characteristic: X7R; Capacitance: 100nF; Temperature Range: -55 to +125 C; Price: 0,0225; Order Code Supplier: 2456106; Supplier: Farnell
C6 = 10uF/0805/CER/10V: Capacitor, 10uF, 10V, X7R; Capacitance Tolerance: ± 10%; Capacitor Case Style: 0805; Brand Number: GRM21BR71A106KE51L; Brand: MURATA; Dielectric Characteristic: X7R; Capacitance: 10uF; Temperature Range: -55°C to +125°C; Price: 0,36; Order Code Supplier: 1828828; Supplier: Farnell
C9 C10 = 18pF/0402/CER/50V: Capacitor, 18pF, 50V, NP0; Capacitance Tolerance: ± 5%; Capacitor Case Style: 0402; Brand Number: GRM1555C1H180JA01D; Brand: MURATA; Dielectric Characteristic: NP0; Capacitance: 18pF; Temperature Range: -55°C to 125°C; Price: 0,0177; Order Code Supplier: 1828876; Supplier: Farnell
IC1 = STM32F303CCT6: MCU, 32BIT CORTEX-M3, 72MHz; Brand: STM; Brand Number: STM32F303CCT6; Supplier: Farnell; Order Code Supplier: 2215113
J15 = MICRO-SD-PP-SDIO: Connector, Micro SD, Push/Push 8; Brand: MOLEX; Brand Number: 502774-0891; Case Style: 49225; Pitch: 1.10mm; Order Code Supplier: 2064063; Price: 2,45; Supplier: Farnell
L3 = BLM18PG330SN1D: as L2 on sheet DB10005_BatteryStackMonitor; Brand Number: BLM18PG330SN1D; Price: 0,048; Supplier: Farnell; Order Code Supplier: 1515742
Q8 = BSS123: as Q11 on sheet DB10005_TopLevel; Brand Number: BSS123; Case Style: SOT-23; Order Code Supplier: 1510764; Price: 0,082; Supplier: Farnell; Temperature Range: -55°C to +150°C; Transistor Polarity: N-channel
R1 R68 = 10k/0402/0063W/50V: Resistor, 10k, 0.1%, 0.0625W, 50V, 100PPM, 0402; Brand: VISHAY DRALORIC; Brand Number: CRCW040210K0FKED; Power Rating: 0.063W; Case Style: 0402; Order Code Supplier: 2121730; Price: 0,0005; Resistance: 10k; Supplier: Farnell; Temperature Coefficient: ± 100PPM; Temperature Range: -55°C to +125°C; Voltage Rating: 50V
R8 = 100k/0402/0063W/50V: as R50 on sheet DB10005_BatteryStackMonitor; Case Style: 0402; Order Code Supplier: 2121857; Price: 0,0004; Resistance: 100K; Supplier: Farnell; Temperature Coefficient: ± 100PPM; Temperature Range: -55°C to +125°C; Voltage Rating: 50V
R66 = 1.5k/0402/0063W/50V: as R72 on sheet DB10005_TopLevel; Case Style: 0402; Order Code Supplier: 2121624; Price: 0,0054; Resistance: 1.5k; Supplier: Farnell; Temperature Coefficient: ± 100PPM; Temperature Range: -55°C to +125°C; Voltage Rating: 50V
X1 = ABM3-8.000MHZ-D2Y-T: 8MHZ, 18PF, 5 X 3.2MM; Brand: ABRACON; Brand Number: ABM3-8.000MHZ-D2Y-T; Order Code Supplier: 2101329; Price: 0,90; Supplier: Farnell

## Sheet DB10005_PowerSwitch.SchDoc: Power switching
size A3; SheetNumber: 5; SheetTotal: 7
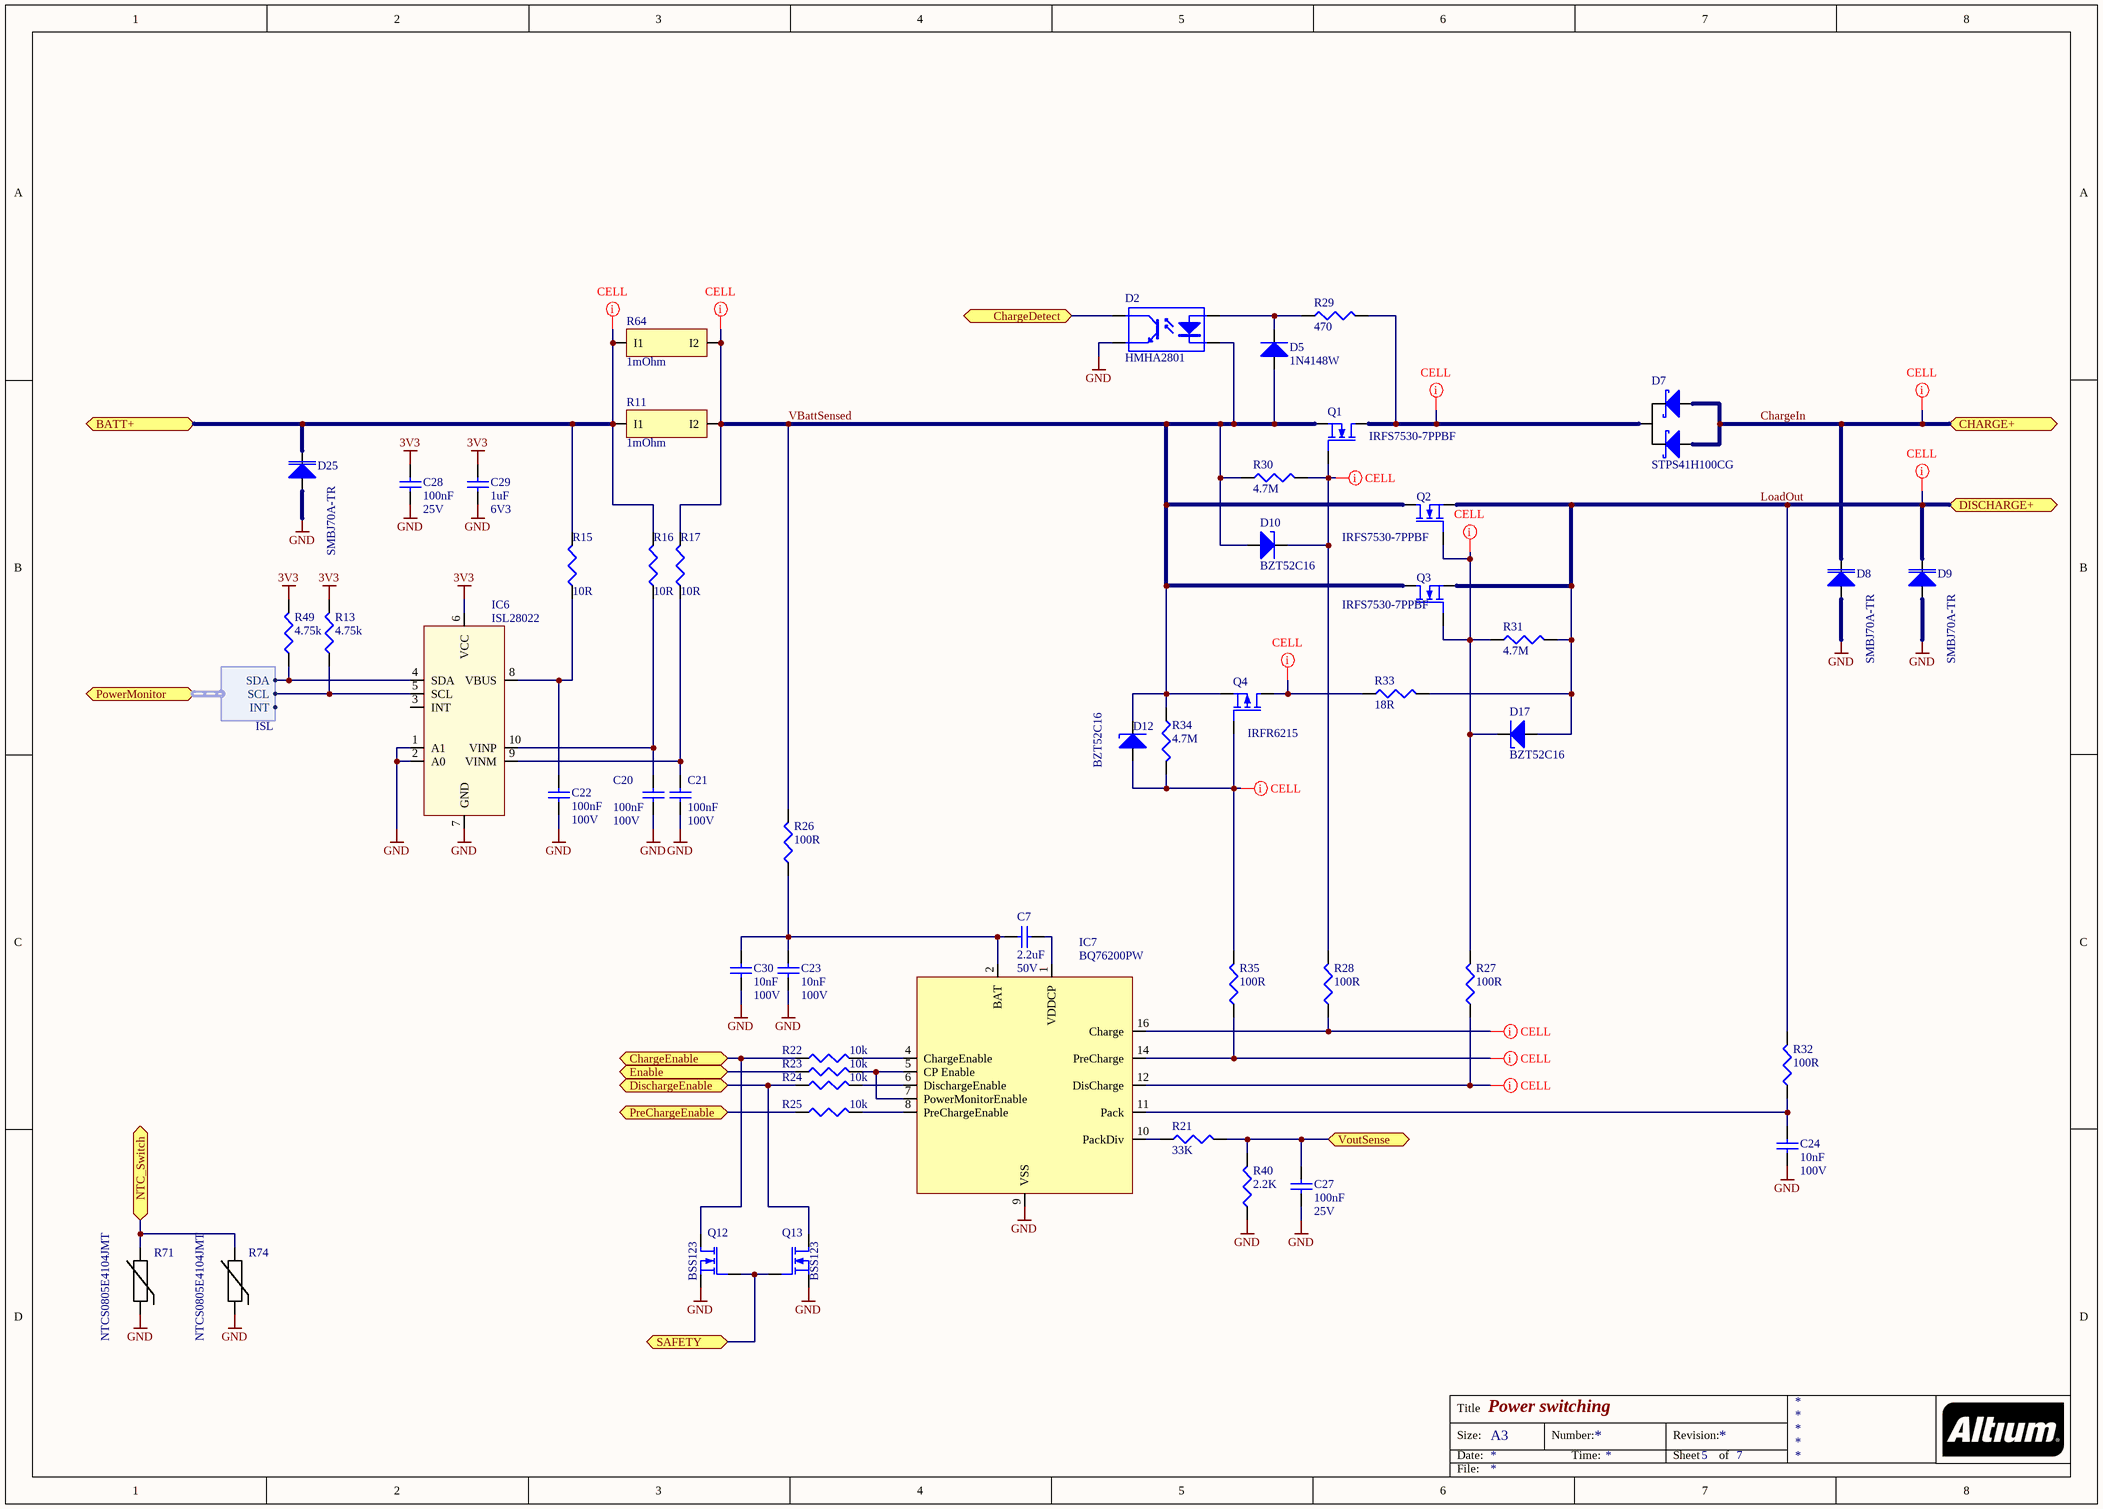
[diagram p4: DB10005_PowerSwitch.SchDoc]

### Parts
C7  2.2uF  Voltage Rating: 50V  [C-0805]
C20  100nF  Voltage Rating: 100V  [C-0805]
C21  100nF  Voltage Rating: 100V  [C-0805]
C22  100nF  Voltage Rating: 100V  [C-0805]
C23  10nF  Voltage Rating: 100V  [C-0805]
C24  10nF  Voltage Rating: 100V  [C-0805]
C27  100nF  Voltage Rating: 25V  [C0402]
C28  100nF  Voltage Rating: 25V  [C0402]
C29  1uF  Voltage Rating: 6V3  [C0402]
C30  10nF  Voltage Rating: 100V  [C-0805]
D2  HMHA2801  [FSOP4]
D5  1N4148W  [SOD123]
D7  STPS41H100CG  [D2-PAK]
D8  SMBJ70A-TR  [SMB]
D9  SMBJ70A-TR  [SMB]
D10  BZT52C16  [SOD123]
D12  BZT52C16  [SOD123]
D17  BZT52C16  [SOD123]
D25  SMBJ70A-TR  [SMB]
IC6  ISL28022  [MSOP10]
IC7  BQ76200PW  [TSSOP16]
Q1  IRFS7530-7PPBF  [D2PAK7]
Q2  IRFS7530-7PPBF  [D2PAK7]
Q3  IRFS7530-7PPBF  [D2PAK7]
Q4  IRFR6215  [D-PAK]
Q12  BSS123  [SOT-23]
Q13  BSS123  [SOT-23]
R11  1mOhm  [FCSL110]
R13  4.75k  [0402]
R15  10R  [0603]
R16  10R  [0603]
R17  10R  [0603]
R21  33K  [0603]
R22  10k  [0402]
R23  10k  [0402]
R24  10k  [0402]
R25  10k  [0402]
R26  100R  [0603]
R27  100R  [0805]
R28  100R  [0805]
R29  470  [0402]
R30  4.7M  [0805]
R31  4.7M  [0805]
R32  100R  [0603]
R33  18R  [SM_3]
R34  4.7M  [0805]
R35  100R  [0805]
R40  2.2K  [0603]
R49  4.75k  [0402]
R64  1mOhm  [FCSL110]
R71  NTCS0805E4104JMT  [0805]
R74  NTCS0805E4104JMT  [0805]

### Ports
BATT+, CHARGE+, ChargeDetect, ChargeEnable, DISCHARGE+, DischargeEnable, Enable, NTC_Switch, PowerMonitor (harness ISL), PreChargeEnable, SAFETY, VoutSense

### Harnesses
ISL: SDA, SCL, INT

### Nets
3V3: C28.2 C29.2 IC6.6(VCC) R13.2 R49.2
GND: C20.1 C21.1 C22.1 C23.1 C24.1 C27.1 C28.1 C29.1 C30.1 D2.3(E1) D8.1 D9.1 D25.1 IC6.1(A1) IC6.2(A0) IC6.7(GND) IC7.9(VSS) Q12.S Q13.S R40.1 R71.1 R74.1
BATT+: D25.2 R11.0(I1) R15.2 R16.2 R64.0(I1) ; port BATT+
ChargeEnable: Q12.D R22.1 ; port ChargeEnable
ChargeIn: D7.A1 D7.A2 D8.2 ; port CHARGE+
DischargeEnable: Q13.D R24.1 ; port DischargeEnable
LoadOut: D9.2 D17.1(A) Q2.S Q3.S R31.2 R32.2 R33.2 ; port DISCHARGE+
PreChargeEnable: R25.1 ; port PreChargeEnable
SCL: IC6.5(SCL) R13.1 ; port PowerMonitor.SCL
SDA: IC6.4(SDA) R49.1 ; port PowerMonitor.SDA
SwitchEnable: R23.1 ; port Enable
VBattSensed: D2.2(K1) D5.1(A) D10.1(A) D12.2(K) Q1.S Q2.D Q3.D Q4.S R11.1(I2) R17.2 R26.2 R30.1 R34.1 R64.1(I2)
VoutSense: C27.2 R21.2 R40.2 ; port VoutSense
NetC7_1: C7.1 C23.2 C30.2 IC7.2(BAT) R26.1
NetC7_2: C7.2 IC7.1(VDDCP)
NetC20_2: C20.2 IC6.10(VINP) R16.1
NetC21_2: C21.2 IC6.9(VINM) R17.1
NetC22_2: C22.2 IC6.8(VBUS) R15.1
NetC24_2: C24.2 IC7.11(Pack) R32.1
NetC42_1: R71.2 R74.2 ; port NTC_Switch
NetD2_1: D2.1(A1) D5.2(K) R29.1
NetD2_4: D2.4(C1) ; port ChargeDetect
NetD7_K: D7.K Q1.D R29.2
NetD10_2: D10.2(K) Q1.G R28.2 R30.2
NetD12_1: D12.1(A) Q4.G R34.2 R35.2
NetD17_2: D17.2(K) Q2.G Q3.G R27.2 R31.1
NetIC1_2: Q12.G Q13.G ; port SAFETY
NetIC7_4: IC7.4(ChargeEnable) R22.2
NetIC7_5: IC7.5(CP_Enable) IC7.7(PowerMonitorEnable) R23.2
NetIC7_6: IC7.6(DischargeEnable) R24.2
NetIC7_8: IC7.8(PreChargeEnable) R25.2
NetIC7_10: IC7.10(PackDiv) R21.1
NetIC7_12: IC7.12(DisCharge) R27.1
NetIC7_14: IC7.14(PreCharge) R35.1
NetIC7_16: IC7.16(Charge) R28.1
NetQ4_D: Q4.D R33.1

Not connected (* = marked no-connect by the designer): IC6 3(INT)

### Layout directives
net class CELL: BATT+, ChargeIn, LoadOut, NetD7_K, NetD10_2, NetD12_1, NetD17_2, NetIC7_12, NetIC7_14, NetIC7_16, NetQ4_D, VBattSensed

### Notes on the sheet
- Title
- Size:
- Date:
- A3
- Number:
- Time:
- Revision:
- Sheet
- of
- File:

### Library data of the parts
C7 = 2.2uF/0805/CER/50V: Capacitor, 2.2uF, 50V,  X7R; Dielectric Characteristic: X5R; Capacitance Tolerance: ± 10%; Capacitor Case Style: 0805; Brand Number: GRM219R61H225KE15D; Brand: MURATA; Capacitance: 2.2uF; Temperature Range: -55°C to +125°C; Price: 0,113; Order Code Supplier: 2611933; Supplier: Farnell
C20-C22 = 100nF/0805/CER/100V: as C37 on sheet DB10005_BatteryStackMonitor; Dielectric Characteristic: X7R; Capacitance: 100nF; Temperature Range: -55°C to +125°C; Price: 0,096; Order Code Supplier: 1650862; Supplier: Farnell
C23 C24 C30 = 10nF/0805/CER/100V: Capacitor, 10nF, 100V, X7R; Capacitance Tolerance: ± 10%; Capacitor Case Style: 0805; Brand Number: 08051C103KAZ2A; Brand: AVX; Dielectric Characteristic: X7R; Capacitance: 10nF; Temperature Range: -55°C to +125°C; Price: 0,131; Order Code Supplier: 1301898; Supplier: Farnell
C27 C28 = 100nF/0402/CER/25V: as C1 on sheet DB10005_Controller; Dielectric Characteristic: X7R; Capacitance: 100nF; Temperature Range: -55 to +125 C; Price: 0,0225; Order Code Supplier: 2456106; Supplier: Farnell
C29 = 1uF/0402/CER/6.3V: as C38 on sheet DB10005_BatteryStackMonitor; Dielectric Characteristic: X5R; Capacitance: 1uF; Temperature Range: -55°C to +85°C; Price: 0,0874; Order Code Supplier: 1327658; Supplier: Farnell
D2 = HMHA2801: Optocoupler, Vout:80V, Iin:0.01A; Brand: FAIRCHILD SEMICONDUCTOR; Isolation Voltage: 2500V; Input Current: 0.01A; Output Voltage: 80V; Brand Number: HMHA2801; Case Style: *; Price: 0,28; Order Code Supplier: 1652504; Supplier: Farnell; Temperature Range: -55°C to +100°C
D5 = MMSD4148T1G: as D21 on sheet DB10005_BatteryStackMonitor; Brand Number: MMSD4148T1G; Forward Voltage: 1V; Order Code Supplier: 9556079; Price: 0,19; Supplier: Farnell; Temperature Range: -65°C to +150°C; Vrrm: 100V
D7 = STPS41H100CG: 100 V, 40 A, TO-263, 3 Pins, 900 mV; Brand: ST. Micro; Brand Number: STPS41H100CG-TR; Forward Current: 2 * 20A; Forward Voltage: 0.9V; Vrrm: 100V; Case Style: TO-263; Order Code Supplier: 2353681; Price: 1,53; Supplier: Farnell; Temperature Range: -55°C to +125°C
D8 D9 D25 = SMBJ70A-TR: Diode TVS, Vrwm: 70V, Vbr: 81.9V, Vc: 113V, Ippm: 27A; Brand: STMICROELECTRONICS; Brand Number: SMBJ70A-TR; Breakdown Voltage: 81.9V; Case Style: SMB; Clamping Voltage: 113V; Ippm: 27A; Order Code Supplier: 9886389; Price: 0,33; Supplier: Farnell; Temperature Range: -55°C to +150°C; Vrwm: 70V
D10 D12 D17 = BZT52C16: Diode Zener, Vz: 16V, If: 0.1A, Vf: 0.9V; Brand: Diodes; Case Style: SOD-123; Brand Number: BZT52C16; Forward Current: 0.1A; Forward Voltage: 0.9V; Order Code Supplier: 1902431; Price: 0,087; Supplier: Farnell; Temperature Range: -65°C to +150°C; Zener Voltage: 16V
IC6 = ISL28022: Current and voltage ADC; Brand Number: ISL28022FUZ; Brand: Intersil; Supplier: Farnell; Case Style: MSOP10; Price: 3,44; Order Code Supplier: 2373594
IC7 = BQ76200PW: Battery protector, Lead Acid; Brand: Texas Instruments; Brand Number: BQ76200PW; Case Style: TSSOP16; Order Code Supplier: 2522565; Price: 4,84; Supplier: Farnell; Temperature Range: -55°C to +155°C
Q1-Q3 = IRFS7530-7PPBF: Mosfet, N-channel, Vds:60V, Id:338A, Vgs-th:3.7V, Rds-on:0.00115ohm; Brand: INTERNATIONAL RECTIFIER; Case Style: TO-263; Drain Current: 338A; Drain Source Voltage: 60V; Gate Source Voltage: 10V; Threshold Voltage: 3.7V; Brand Number: IRFS7530-7PPBF; On Resistance: 0.00115ohm; Order Code Supplier: 2580027; Price: 4,40; Supplier: Farnell; Temperature Range: -55°C to +175°C; Transistor Polarity: N-Channel
Q4 = IRFR6215TRPBF: Mosfet, P-channel, Vds:150V, Id:13A, Vgs-th:4V, Rds-on:0.295ohm; Brand: INTERNATIONAL RECTIFIER; Brand Number: IRFR6215PBF; Drain Current: 13A; Drain Source Voltage: 150V; Gate Source Voltage: 20V; Threshold Voltage: 4; Case Style: D-PAK; On Resistance: 0.295ohm; Order Code Supplier: 1839002; Price: 0,94; Supplier: Farnell; Temperature Range: -55°C to +175°C; Transistor Polarity: P-channel
Q12 Q13 = BSS123: as Q11 on sheet DB10005_TopLevel; Brand Number: BSS123; Case Style: SOT-23; Order Code Supplier: 1510764; Price: 0,082; Supplier: Farnell; Temperature Range: -55°C to +150°C; Transistor Polarity: N-channel
R11 R64 = FCSL110R001JER: 1mohm, 5 W, ± 5%, 4320 Wide; Brand: Ohmite; Order Code Supplier: 2420535; Price: 3,81; Brand Number: FCSL110R001JER; Supplier: Farnell
R13 R49 = 4.75k/0402/0063W/50V: as R18 on sheet DB10005_TopLevel; Case Style: 0402; Order Code Supplier: 2121689; Price: 0,0006; Resistance: 4.75k; Supplier: Farnell; Temperature Coefficient: ± 100PPM; Temperature Range: -55°C to +125°C; Voltage Rating: 50V
R15-R17 = 10/0603/0063W/50V: Resistor, 10R, 1%, 0.063W, 50V, 200PPM, 0603; Brand: VISHAY DRALORIC; Brand Number: CRCW060310R0FKEA; Case Style: 0603; Order Code Supplier: 2122113; Power Rating: 0.063W; Price: 0,038; Resistance: 10R; Supplier: Farnell; Temperature Coefficient: ± 200PPM; Temperature Range: -55°C to +125°C; Voltage Rating: 50V
R21 = 33K/0603/0063W/50V: Resistor, 33K, 1%, 0.063W, 50V, 100PPM, 0603; Brand: VISHAY DRALORIC; Brand Number: CRCW060333K0FKEA; Case Style: 0603; Order Code Supplier: 2122555; Power Rating: 0.063W; Price: 0,038; Resistance: 33K; Supplier: Farnell; Temperature Coefficient: ± 100PPM; Temperature Range: -55°C to +125°C; Voltage Rating: 50V
R22-R25 = 10k/0402/0063W/50V: as R1 on sheet DB10005_Controller; Case Style: 0402; Order Code Supplier: 2121730; Price: 0,0005; Resistance: 10k; Supplier: Farnell; Temperature Coefficient: ± 100PPM; Temperature Range: -55°C to +125°C; Voltage Rating: 50V
R26 R32 = 100/0603/0063W/50V: as R63 on sheet DB10005_BatteryStackMonitor; Case Style: 0603; Order Code Supplier: 2122239; Power Rating: 0.063W; Price: 0,007; Resistance: 100R; Supplier: Farnell; Temperature Coefficient: ± 200PPM; Temperature Range: -55°C to +125°C; Voltage Rating: 50V
R27 R28 R35 = 100/0805/0250W/150V: Resistor, 100R, 1%, 0.25W, 150V, 100PPM, 0805; Brand: MULTICOMP; Brand Number: MCHP05W4F1000T5E; Case Style: 0805; Order Code Supplier: 1576445; Power Rating: 0.25W; Price: 0,089; Resistance: 100R; Supplier: Farnell; Temperature Coefficient: ± 100PPM; Temperature Range: -55°C to +155°C; Voltage Rating: 150V
R29 = 470/0402/0063W/50V: as R9 on sheet DB10005_TopLevel; Case Style: 0402; Order Code Supplier: 2331533; Price: 0,0099; Resistance: 470; Supplier: Farnell; Temperature Coefficient: ± 100PPM; Temperature Range: -55°C to +125°C; Voltage Rating: 50V
R30 R31 R34 = 4.7M/0805/0250W/150V: Resistor, 4.7M, 1%, 0.25W, 150V, 100PPM, 0805; Brand: MULTICOMP; Brand Number: MCHP05W4F4704T5E; Case Style: 0805; Order Code Supplier: 1576516; Power Rating: 0.25W; Price: 0,089; Resistance: 4.7M; Supplier: Farnell; Temperature Coefficient: ± 100PPM; Temperature Range: -55°C to +155°C; Voltage Rating: 150V
R33 = 18: Resistor Wirewound, 18R, 5%, 3W, 500V, 200PPM, SMW; Brand: TE CONNECTIVITY / CGS; Brand Number: SMW318RJT; Case Style: SMW; Order Code Supplier: 1086385; Power Rating: 3W; Price: 0,80; Resistance: 18R; Supplier: Farnell; Temperature Coefficient: ± 200PPM; Temperature Range: -55°C to +200°C; Voltage Rating: 500V
R40 = 2.2K/0603/0063W/50V: Resistor, 2.2K, 1%, 0.063W, 50V, 100PPM, 0603; Brand: VISHAY DRALORIC; Brand Number: CRCW06032K20FKEA; Case Style: 0603; Order Code Supplier: 2122405; Power Rating: 0.063W; Price: 0,038; Resistance: 2.2K; Supplier: Farnell; Temperature Coefficient: ± 100PPM; Temperature Range: -55°C to +125°C; Voltage Rating: 50V
R71 R74 = NTCS0805E4104JMT: THERMISTOR, NTC, 100K, 5%; Brand: VISHAY; Supplier: Farnell; Case Style: 0805; Price: 0,65; Order Code Supplier: 1187095; Brand Number: NTCS0805E4104JMT

## Sheet DB10005_PowerManagement.SchDoc: Power management
size A4; SheetNumber: 4; SheetTotal: 7
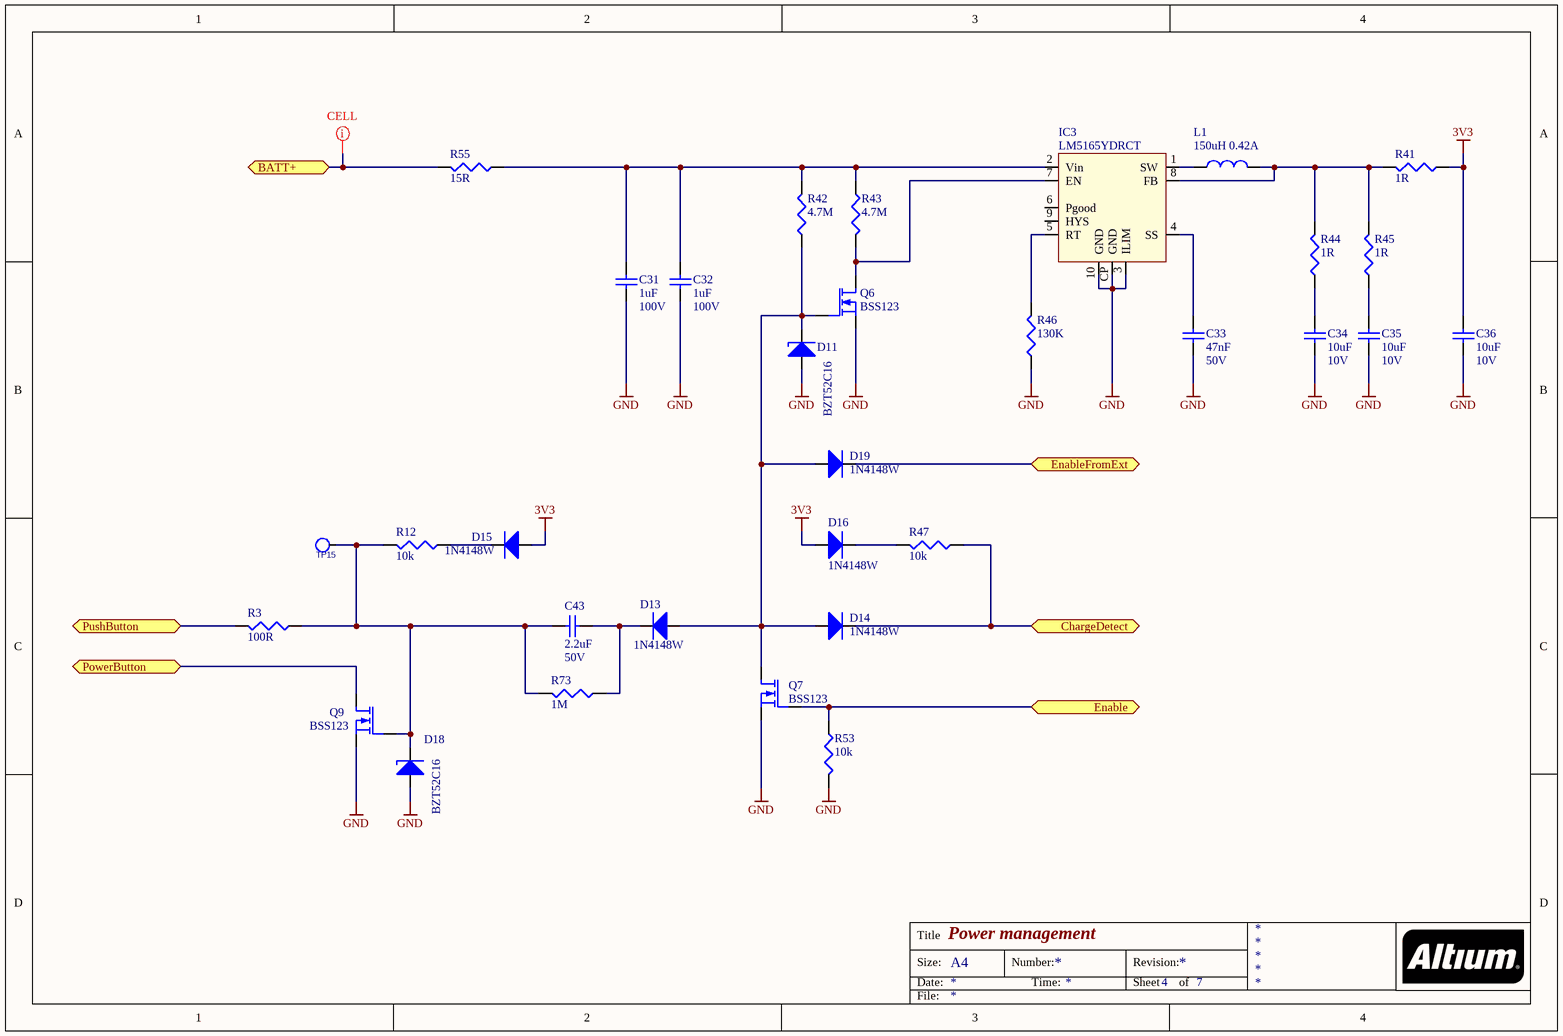
[diagram p5: DB10005_PowerManagement.SchDoc]

### Parts
C31  1uF  Voltage Rating: 100V  [C-1206]
C32  1uF  Voltage Rating: 100V  [C-1206]
C33  47nF  Voltage Rating: 50V  [C0603]
C34  10uF  Voltage Rating: 10V  [C-0805]
C35  10uF  Voltage Rating: 10V  [C-0805]
C36  10uF  Voltage Rating: 10V  [C-0805]
C43  2.2uF  Voltage Rating: 50V  [C-0805]
D11  BZT52C16  [SOD123]
D13  1N4148W  [SOD123]
D14  1N4148W  [SOD123]
D15  1N4148W  [SOD123]
D16  1N4148W  [SOD123]
D18  BZT52C16  [SOD123]
D19  1N4148W  [SOD123]
IC3  LM5165YDRCT  [PWSON10]
L1  150uH 0.42A  [WE-TPC 4828, MH]
Q6  BSS123  [SOT-23]
Q7  BSS123  [SOT-23]
Q9  BSS123  [SOT-23]
R3  100R  [0805]
R12  10k  [0402]
R41  1R  [0805]
R42  4.7M  [0805]
R43  4.7M  [0805]
R44  1R  [0805]
R45  1R  [0805]
R46  130K  [0603]
R47  10k  [0402]
R53  10k  [0402]
R55  15R  [0805]
R73  1M  [0402]
TP15  1.3TP  [TP2-1.3MM]  (value not drawn)  (no BOM)

### Ports
BATT+, ChargeDetect, Enable, EnableFromExt, PowerButton, PushButton

### Nets
3V3: C36.2 D15.1(A) D16.1(A) R41.1
GND: C31.1 C32.1 C33.1 C34.1 C35.1 C36.1 D11.1(A) D18.1(A) IC3.3(ILIM) IC3.10(GND) IC3.CP(GND) Q6.S Q7.S Q9.S R46.1 R53.2
PowerButton: Q9.D ; port PowerButton
PowerEnable: Q7.G R53.1 ; port Enable
PushButton: R3.2 ; port PushButton
NetC31_2: C31.2 C32.2 IC3.2(Vin) R42.2 R43.1 R55.1
NetC33_2: C33.2 IC3.4(SS)
NetC34_2: C34.2 R44.1
NetC35_2: C35.2 R45.1
NetC43_1: C43.1 D18.2(K) Q9.G R3.1 R12.2 R73.2 TP15.1(TP)
NetC43_2: C43.2 D13.2(K) R73.1
NetD2_4: D14.2(K) R47.1 ; port ChargeDetect
NetD6_4: D19.2(K) ; port EnableFromExt
NetD11_2: D11.2(K) D13.1(A) D14.1(A) D19.1(A) Q6.G Q7.D R42.1
NetD15_2: D15.2(K) R12.1
NetD16_2: D16.2(K) R47.2
NetF1_1: R55.2 ; port BATT+
NetIC3_1: IC3.1(SW) L1.1
NetIC3_5: IC3.5(RT) R46.2
NetIC3_7: IC3.7(EN) Q6.D R43.2
NetIC3_8: IC3.8(FB) L1.2 R41.2 R44.2 R45.2

Not connected (* = marked no-connect by the designer): IC3 6(Pgood) 9(HYS)

### Layout directives
net class CELL: NetF1_1

### Notes on the sheet
- Title
- Size:
- Date:
- A4
- Number:
- Time:
- Revision:
- Sheet
- of
- File:

### Library data of the parts
C31 C32 = 1uF/1206/CER/100V: Capacitor, 1uF, 100V, X7R; Capacitance Tolerance: ± 10%; Capacitor Case Style: 1206; Brand Number: 12061C105K4Z2A; Brand: AVX; Dielectric Characteristic: X7R; Capacitance: 1uF; Temperature Range: -55°C to +125°C; Price: 0,52; Order Code Supplier: 1833855; Supplier: Farnell
C33 = 47nF/0603/CER/50V: Capacitor, 47nF, 50V, X7R; Capacitance Tolerance: ± 10%; Capacitor Case Style: 0603; Brand Number: MCCA000249; Brand: MULTICOMP; Dielectric Characteristic: X7R; Capacitance: 47nF; Temperature Range: -55°C to +125°C; Price: 0,009; Order Code Supplier: 1759116; Supplier: Farnell
C34-C36 = 10uF/0805/CER/10V: as C6 on sheet DB10005_Controller; Dielectric Characteristic: X7R; Capacitance: 10uF; Temperature Range: -55°C to +125°C; Price: 0,36; Order Code Supplier: 1828828; Supplier: Farnell
C43 = 2.2uF/0805/CER/50V: as C7 on sheet DB10005_PowerSwitch; Capacitance: 2.2uF; Temperature Range: -55°C to +125°C; Price: 0,113; Order Code Supplier: 2611933; Supplier: Farnell
D11 D18 = BZT52C16: as D10 on sheet DB10005_PowerSwitch; Brand Number: BZT52C16; Forward Current: 0.1A; Forward Voltage: 0.9V; Order Code Supplier: 1902431; Price: 0,087; Supplier: Farnell; Temperature Range: -65°C to +150°C; Zener Voltage: 16V
D13-D16 D19 = MMSD4148T1G: as D21 on sheet DB10005_BatteryStackMonitor; Price: 0,19; Brand Number: MMSD4148T1G; Order Code Supplier: 9556079; Supplier: Farnell; Temperature Range: -65°C to +150°C; Vrrm: 100V; Forward Voltage: 1V
IC3 = LM5165Y: Buck Vreg 150mA 3V3 out 5-65Vin; Brand: Texas Instruments; Case Style: MSOP-8; Price: 3,70; Order Code Supplier: 595-LM5165YDRCT; Brand Number: LM5165YDRCT; Temperature Range: -40°C to +85°C; Supplier: Mouser
L1 = 744043151: 150UH, 30%, 0.42A; Brand: Wurth; Case Style: WE-TPC 4828; DC Resistance: 0.770ohm; Brand Number: 744043151; DC Current: 0.42A; Inductance: 150uH; Order Code Supplier: 2082517; Price: 1,36; Q Factor: *; Supplier: Farnell; Temperature Range: -40°C to +125°C
Q6 Q7 Q9 = BSS123: as Q11 on sheet DB10005_TopLevel; Brand Number: BSS123; Case Style: SOT-23; Order Code Supplier: 1510764; Price: 0,082; Supplier: Farnell; Temperature Range: -55°C to +150°C; Transistor Polarity: N-channel
R3 = 100/0805/0250W/150V: as R27 on sheet DB10005_PowerSwitch; Case Style: 0805; Order Code Supplier: 1576445; Power Rating: 0.25W; Price: 0,089; Resistance: 100R; Supplier: Farnell; Temperature Coefficient: ± 100PPM; Temperature Range: -55°C to +155°C; Voltage Rating: 150V
R12 R47 R53 = 10k/0402/0063W/50V: as R1 on sheet DB10005_Controller; Case Style: 0402; Order Code Supplier: 2121730; Price: 0,0005; Resistance: 10k; Supplier: Farnell; Temperature Coefficient: ± 100PPM; Temperature Range: -55°C to +125°C; Voltage Rating: 50V
R41 R44 R45 = 1/0805/0250W/150V: Resistor, 1R, 1%, 0.25W, 150V, 200PPM, 0805; Brand: PANASONIC; Brand Number: ERJ6BQF1R0V; Case Style: 0805; Order Code Supplier: 1717826; Power Rating: 0.25W; Price: 0,28; Resistance: 1R; Supplier: Farnell; Temperature Coefficient: ± 200PPM; Temperature Range: -55°C to +125°C; Voltage Rating: 150V
R42 R43 = 4.7M/0805/0250W/150V: as R30 on sheet DB10005_PowerSwitch; Case Style: 0805; Order Code Supplier: 1576516; Power Rating: 0.25W; Price: 0,089; Resistance: 4.7M; Supplier: Farnell; Temperature Coefficient: ± 100PPM; Temperature Range: -55°C to +155°C; Voltage Rating: 150V
R46 = 130K/0603/0063W/50V: Resistor, 130K, 1%, 0.063W, 50V, 100PPM, 0603; Brand: VISHAY DRALORIC; Brand Number: CRCW0603130KFKEA; Case Style: 0603; Order Code Supplier: 2122632; Power Rating: 0.063W; Price: 0,017; Resistance: 130K; Supplier: Farnell; Temperature Coefficient: ± 100PPM; Temperature Range: -55°C to +125°C; Voltage Rating: 50V
R55 = 15/0805/0125W/150V: Resistor, 15R, 0.1%, 0.125W, 150V, 15PPM, 0805; Brand: YAGEO; Brand Number: RC0805JR-0715RL; Case Style: 0805; Order Code Supplier: 9233784; Power Rating: 0.125W; Price: 0,0161; Resistance: 15R; Supplier: Farnell; Temperature Coefficient: ± 15PPM; Temperature Range: -55°C to +155°C; Voltage Rating: 150V
R73 = 1M/0402/0063W/50V: as R57 on sheet DB10005_BatteryStackMonitor; Case Style: 0402; Order Code Supplier: 2121984; Price: 0,0006; Resistance: 1M; Supplier: Farnell; Temperature Coefficient: ± 100PPM; Temperature Range: -55°C to +125°C; Voltage Rating: 50V
TP15 = TESTPT4: 1.3mm

## Sheet DB10005_CAN.SchDoc: CAN interface
size A4; SheetNumber: 6; SheetTotal: 7
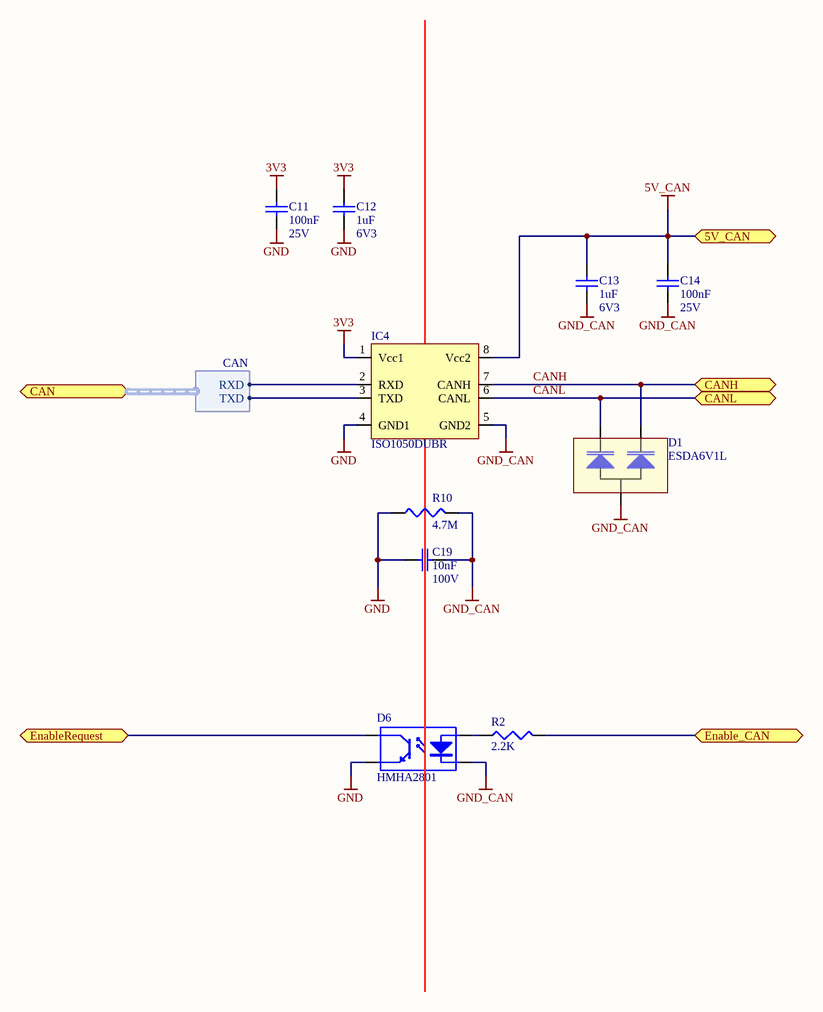
[diagram p6: DB10005_CAN.SchDoc]

### Parts
C11  100nF  Voltage Rating: 25V  [C0402]
C12  1uF  Voltage Rating: 6V3  [C0402]
C13  1uF  Voltage Rating: 6V3  [C0402]
C14  100nF  Voltage Rating: 25V  [C0402]
C19  10nF  Voltage Rating: 100V  [C-0805]
D1  ESDA6V1L  [SOT23]
D6  HMHA2801  [FSOP4]
IC4  ISO1050DUBR  [PDSO8]
R2  2.2K  [0603]
R10  4.7M  [0805]

### Ports
5V_CAN, CAN (harness CAN), CANH, CANL, Enable_CAN, EnableRequest

### Harnesses
CAN: RXD, TXD

### Nets
3V3: C11.2 C12.2 IC4.1(Vcc1)
5V_CAN: C13.2 C14.2 IC4.8(Vcc2) ; port 5V_CAN
GND: C11.1 C12.1 C19.1 D6.3(E1) IC4.4(GND1) R10.1
GND_CAN: C13.1 C14.1 C19.2 D1.A D6.2(K1) IC4.5(GND2) R10.2
CAN_RX: IC4.2(RXD) ; port CAN.RXD
CAN_TX: IC4.3(TXD) ; port CAN.TXD
CANH: D1.K1 IC4.7(CANH) ; port CANH
CANL: D1.K2 IC4.6(CANL) ; port CANL
Enable_CAN: R2.2 ; port Enable_CAN
NetD6_1: D6.1(A1) R2.1
NetD6_4: D6.4(C1) ; port EnableRequest

### Notes on the sheet
- Title
- Size:
- Date:
- A4
- Number:
- Time:
- Revision:
- Sheet
- of
- File:

### Library data of the parts
C11 C14 = 100nF/0402/CER/25V: as C1 on sheet DB10005_Controller; Dielectric Characteristic: X7R; Capacitance: 100nF; Temperature Range: -55 to +125 C; Price: 0,0225; Order Code Supplier: 2456106; Supplier: Farnell
C12 C13 = 1uF/0402/CER/6.3V: as C38 on sheet DB10005_BatteryStackMonitor; Dielectric Characteristic: X5R; Capacitance: 1uF; Temperature Range: -55°C to +85°C; Price: 0,0874; Order Code Supplier: 1327658; Supplier: Farnell
C19 = 10nF/0805/CER/100V: as C23 on sheet DB10005_PowerSwitch; Dielectric Characteristic: X7R; Capacitance: 10nF; Temperature Range: -55°C to +125°C; Price: 0,131; Order Code Supplier: 1301898; Supplier: Farnell
D1 = ESDA6V1L: Diode TVS Dual, Vrwm: 5.25V, Vbr: 7.2V, Vc: 12.45V, Ippm: 15A; Brand: STMICROELECTRONICS; Case Style: SOT-23; Brand Number: ESDA6V1L; Breakdown Voltage: 7.2V; Clamping Voltage: 12.45V; Ippm: 15A; Order Code Supplier: 9802258; Price: 0,62; Supplier: Farnell; Temperature Range: -40°C to +125°C; Vrwm: 5.25V
D6 = HMHA2801: as D2 on sheet DB10005_PowerSwitch; Brand Number: HMHA2801; Case Style: *; Price: 0,28; Order Code Supplier: 1652504; Supplier: Farnell; Temperature Range: -55°C to +100°C
IC4 = ISO1050DUBR: CAN TRANSCEIVER; Brand: Texas Instruments; Case Style: SO8; Brand Number: ISO1050DUBR; Order Code Supplier: 1755712; Price: 5,44; Supplier: Farnell; Temperature Range: -55°C to +155°C
R2 = 2.2K/0603/0063W/50V: as R40 on sheet DB10005_PowerSwitch; Case Style: 0603; Order Code Supplier: 2122405; Power Rating: 0.063W; Price: 0,038; Resistance: 2.2K; Supplier: Farnell; Temperature Coefficient: ± 100PPM; Temperature Range: -55°C to +125°C; Voltage Rating: 50V
R10 = 4.7M/0805/0250W/150V: as R30 on sheet DB10005_PowerSwitch; Case Style: 0805; Order Code Supplier: 1576516; Power Rating: 0.25W; Price: 0,089; Resistance: 4.7M; Supplier: Farnell; Temperature Coefficient: ± 100PPM; Temperature Range: -55°C to +155°C; Voltage Rating: 150V